# Altium schematic sheet INV.ControlMCU.SchDoc
size 1651 x 1651 mm; SheetNumber: 1; SheetTotal: 3
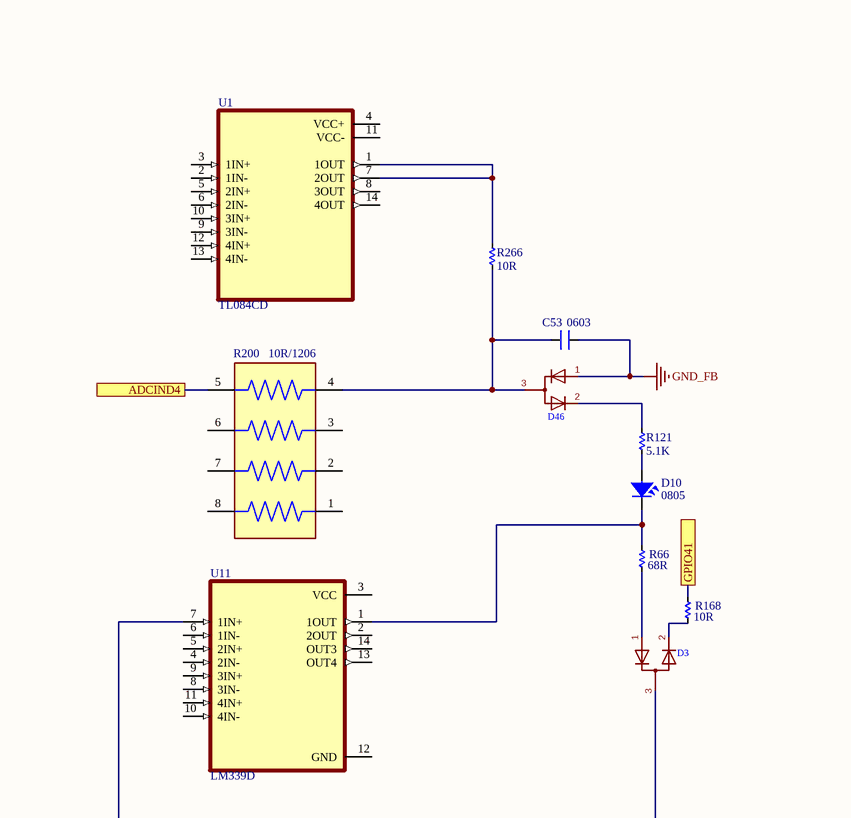
[diagram p0: INV.ControlMCU.SchDoc, top column 1 of 4]
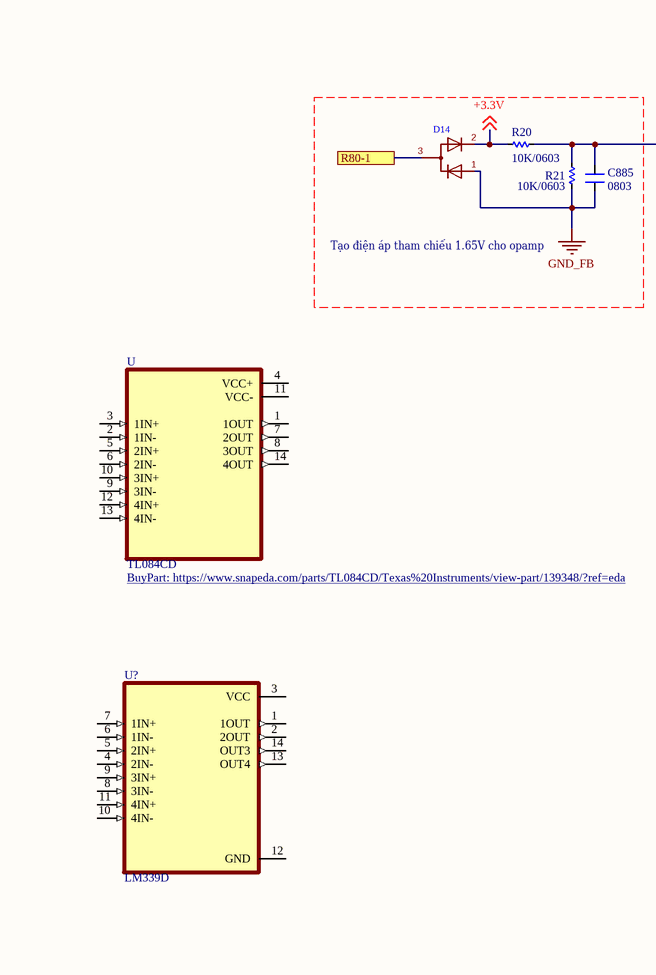
[diagram p1: INV.ControlMCU.SchDoc, top column 3 of 4]
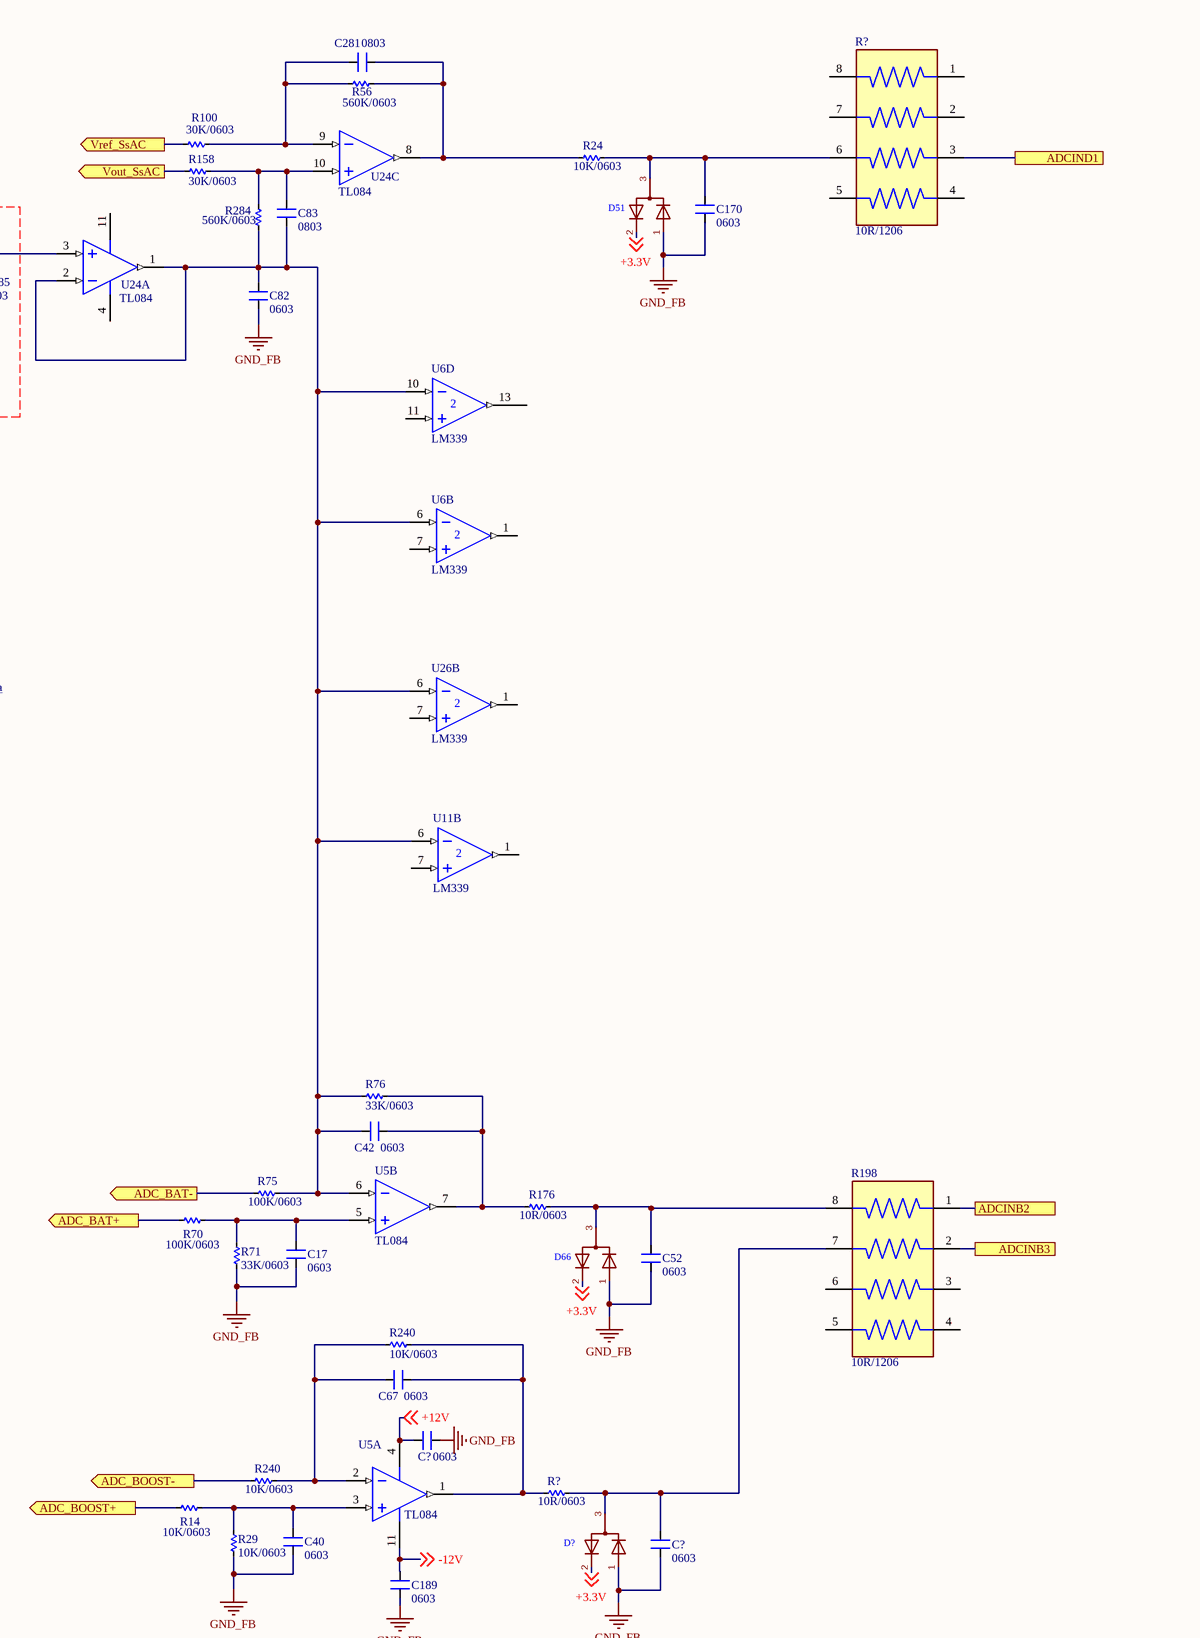
[diagram p2: INV.ControlMCU.SchDoc, top column 4 of 4]
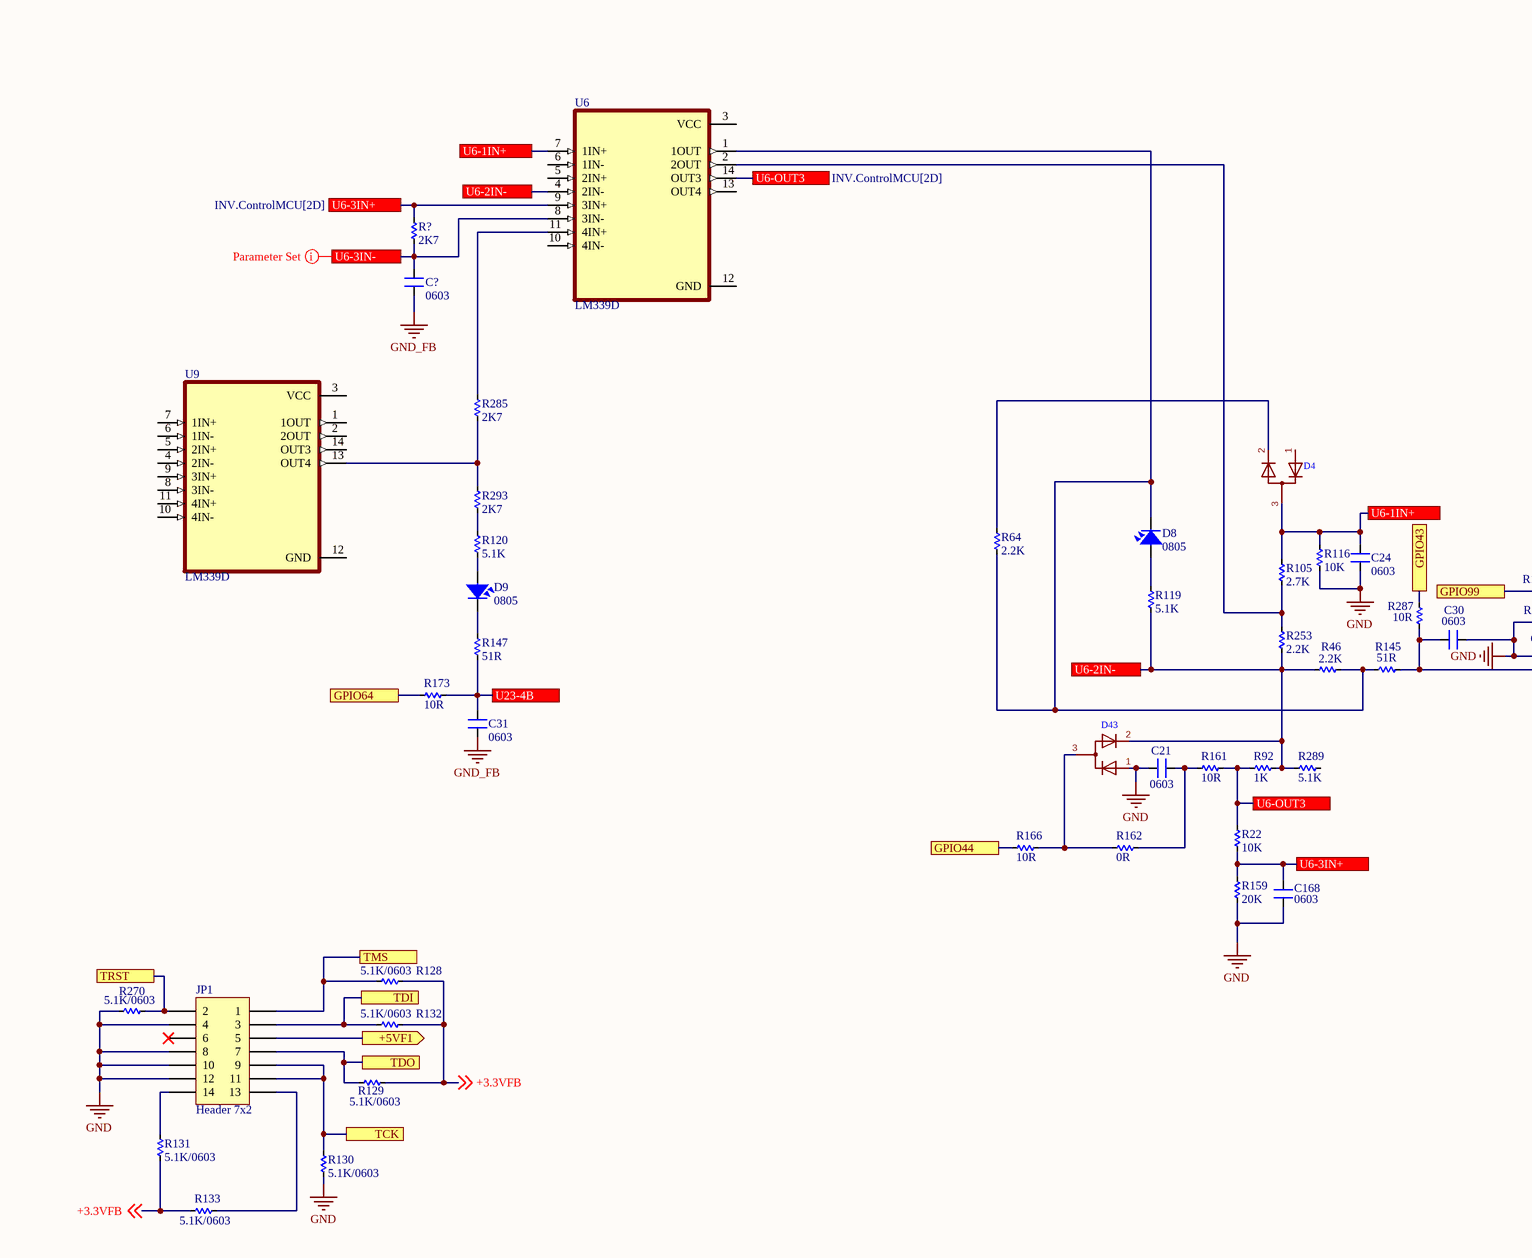
[diagram p3: INV.ControlMCU.SchDoc, centre column 1 of 4]
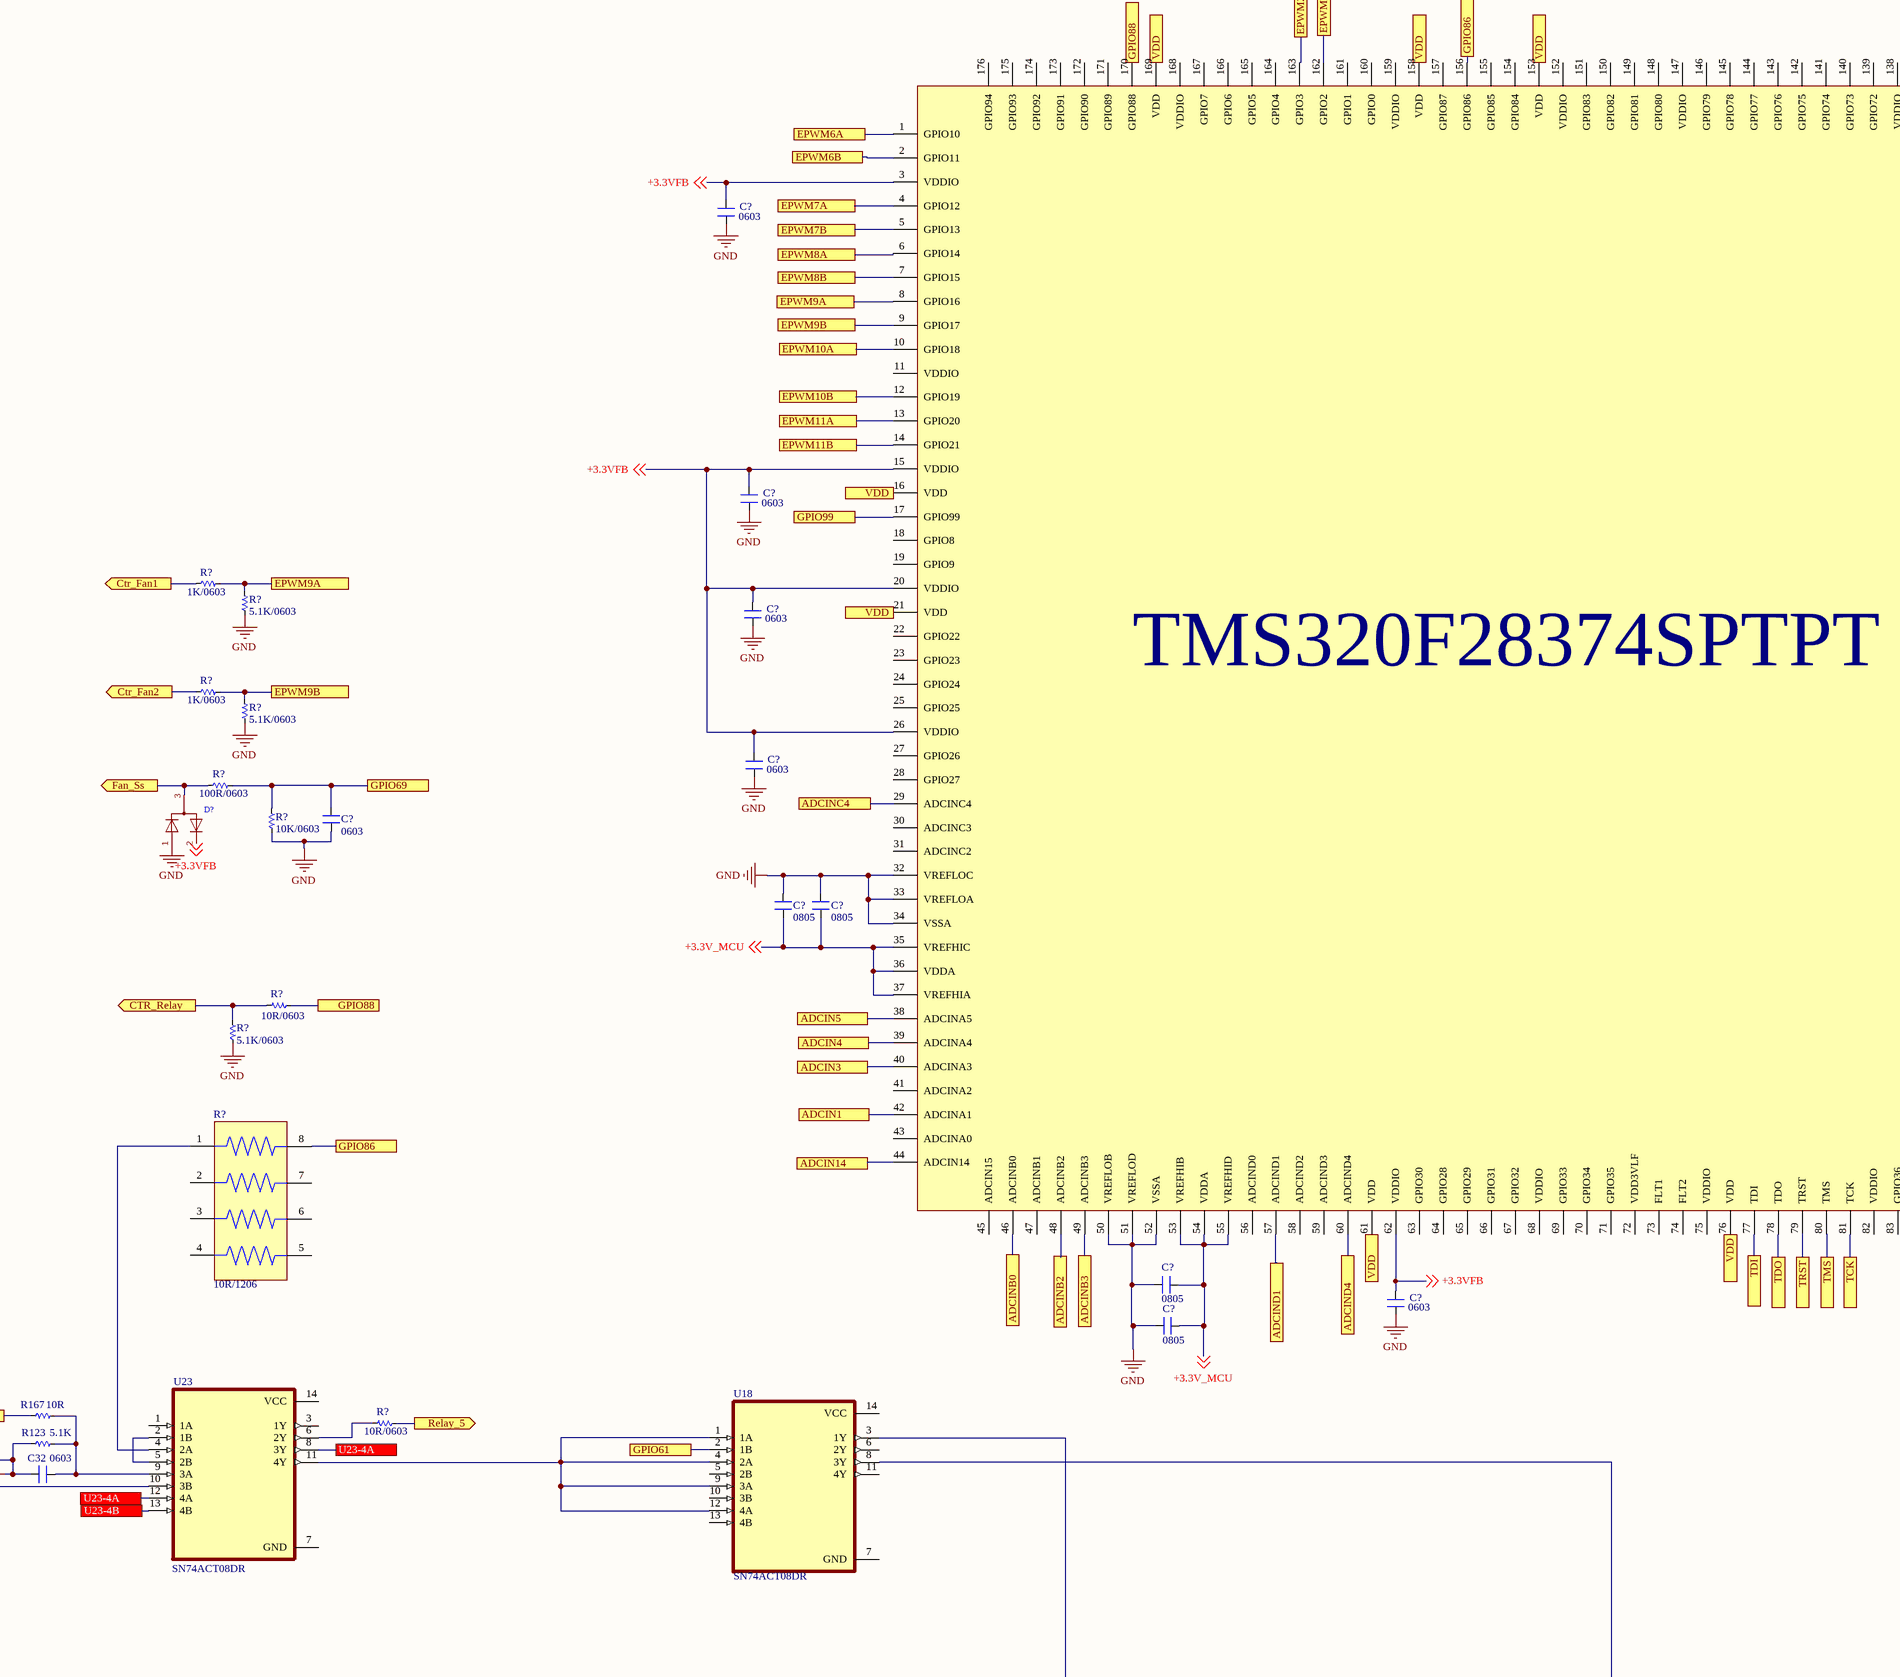
[diagram p4: INV.ControlMCU.SchDoc, centre column 2 of 4]
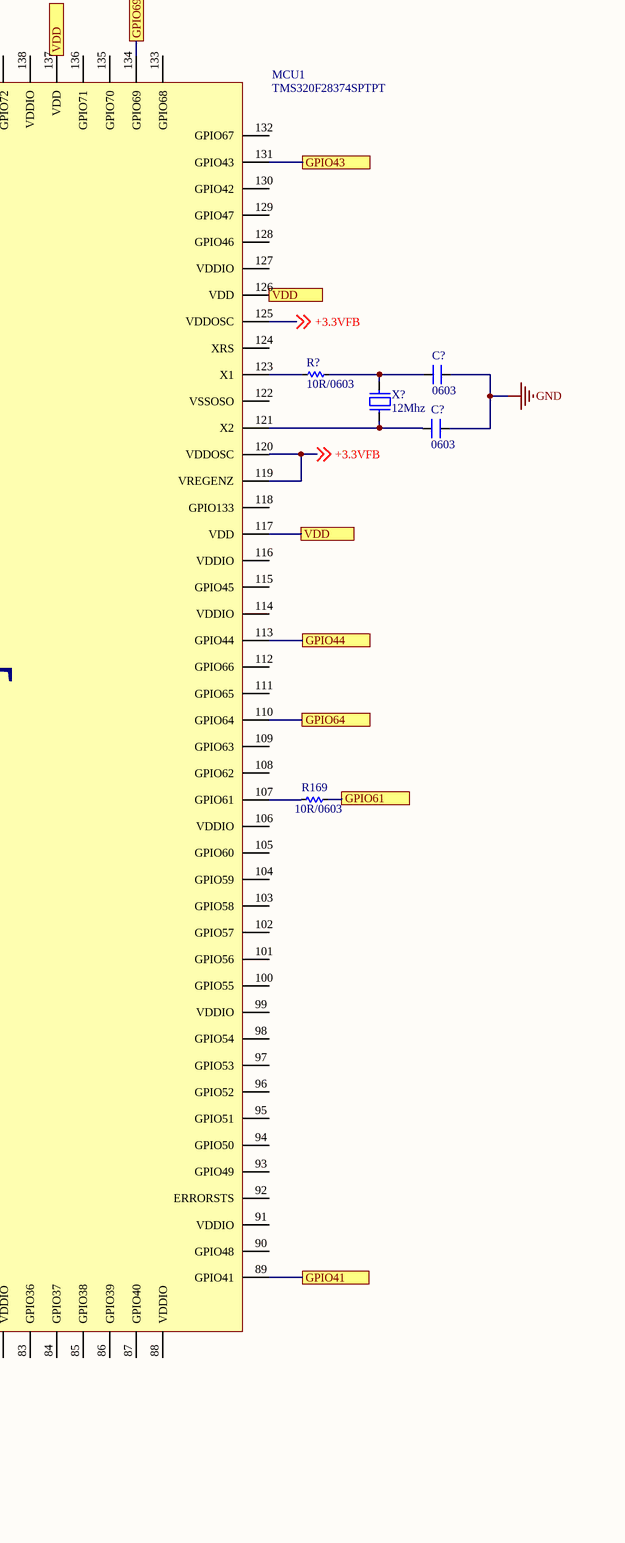
[diagram p5: INV.ControlMCU.SchDoc, centre column 3 of 4]
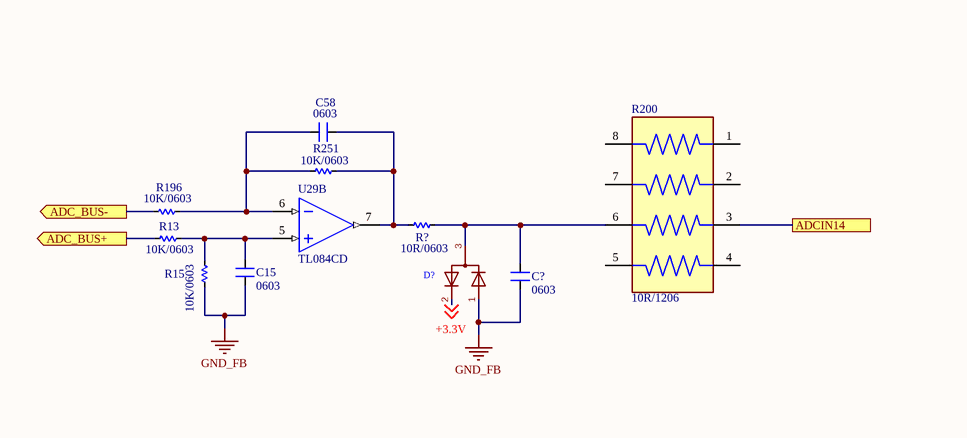
[diagram p6: INV.ControlMCU.SchDoc, centre column 4 of 4]
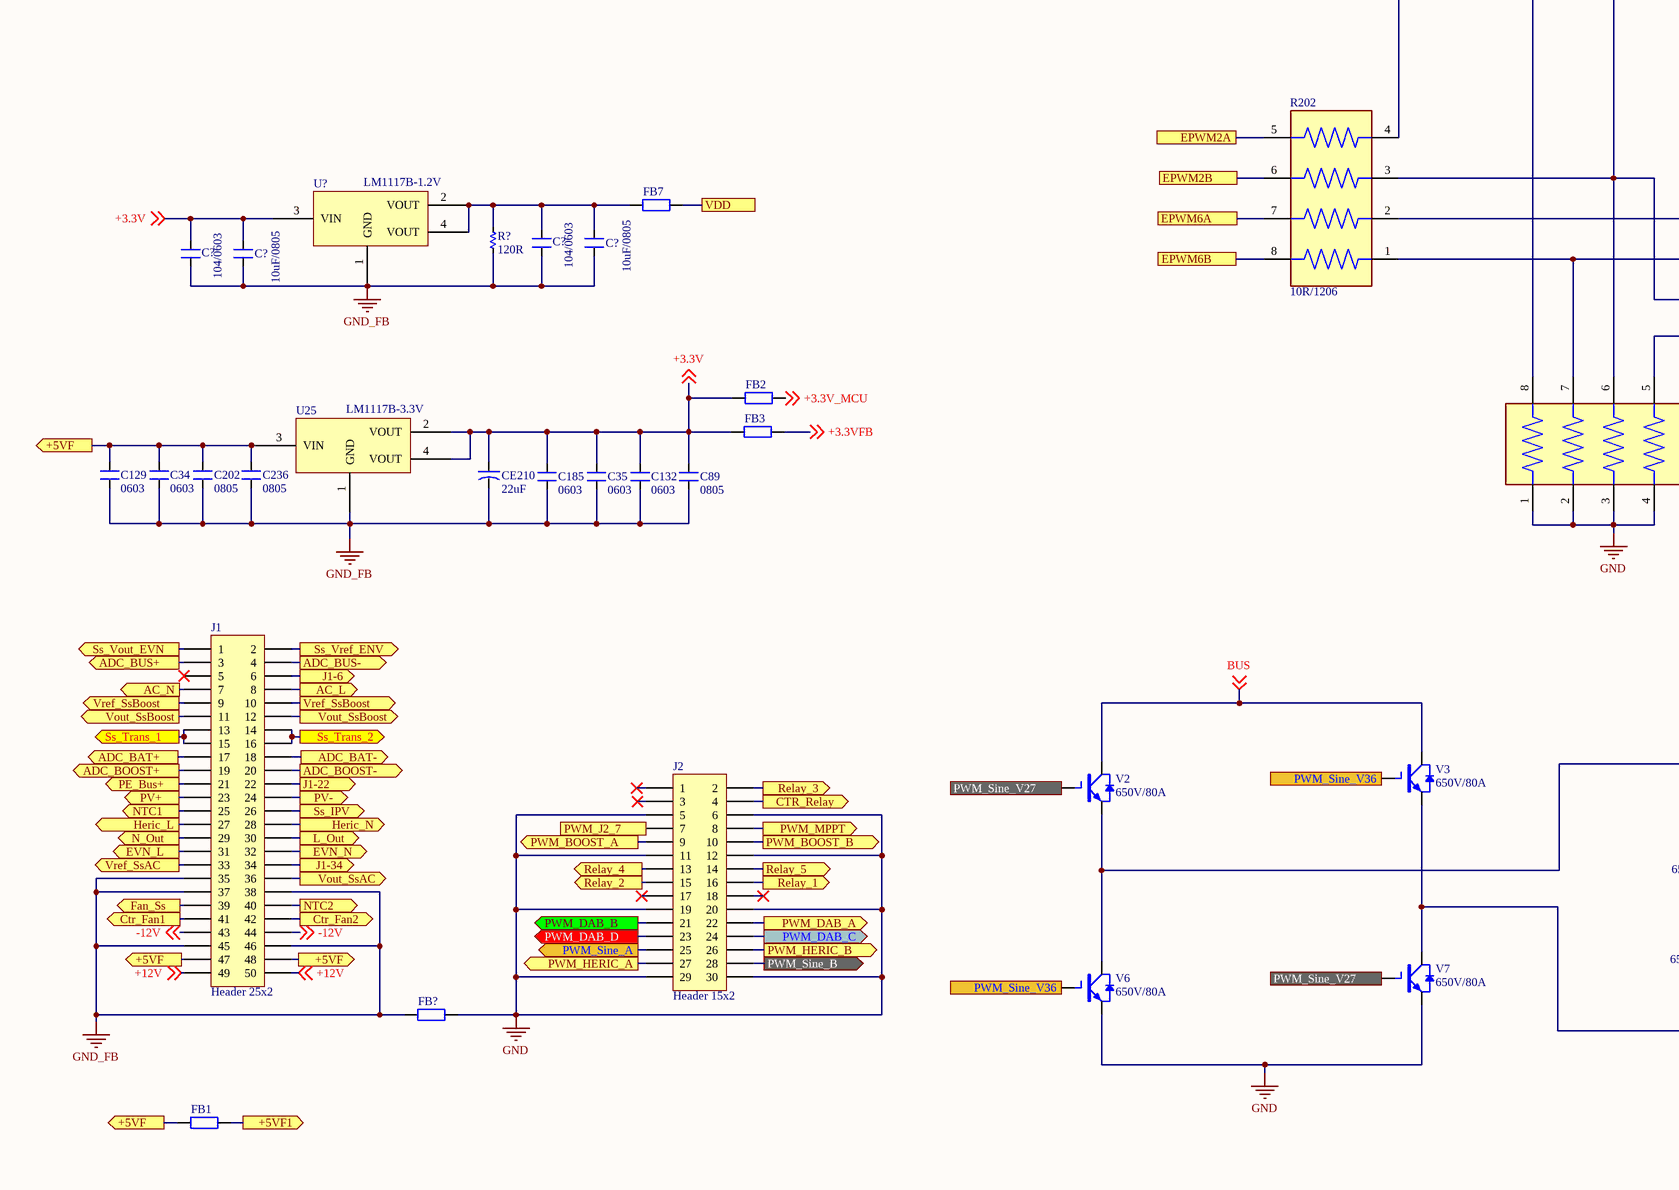
[diagram p7: INV.ControlMCU.SchDoc, bottom column 1 of 4]
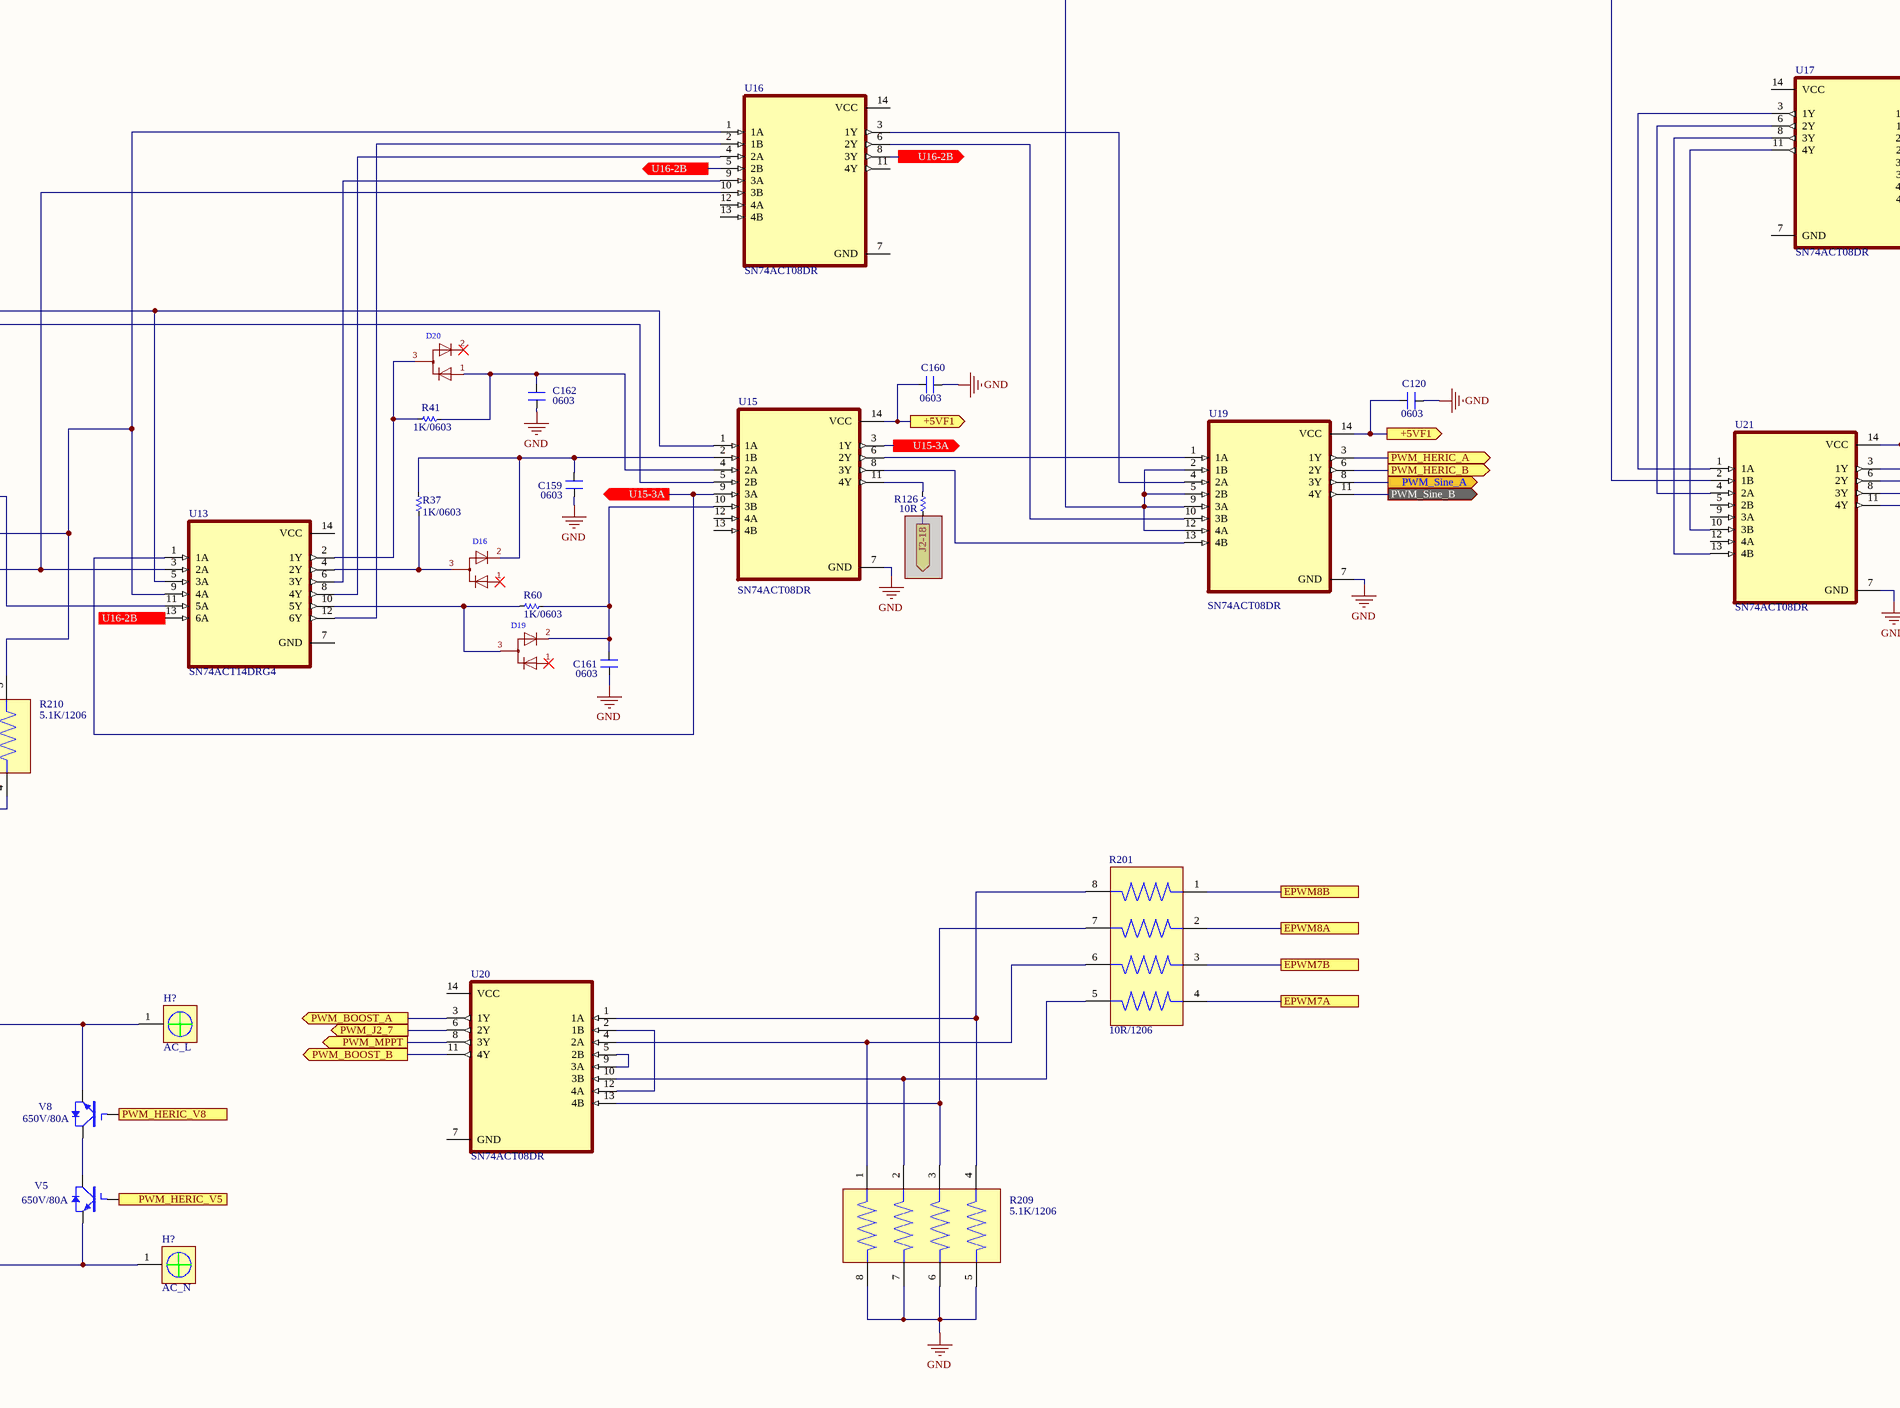
[diagram p8: INV.ControlMCU.SchDoc, bottom column 2 of 4]
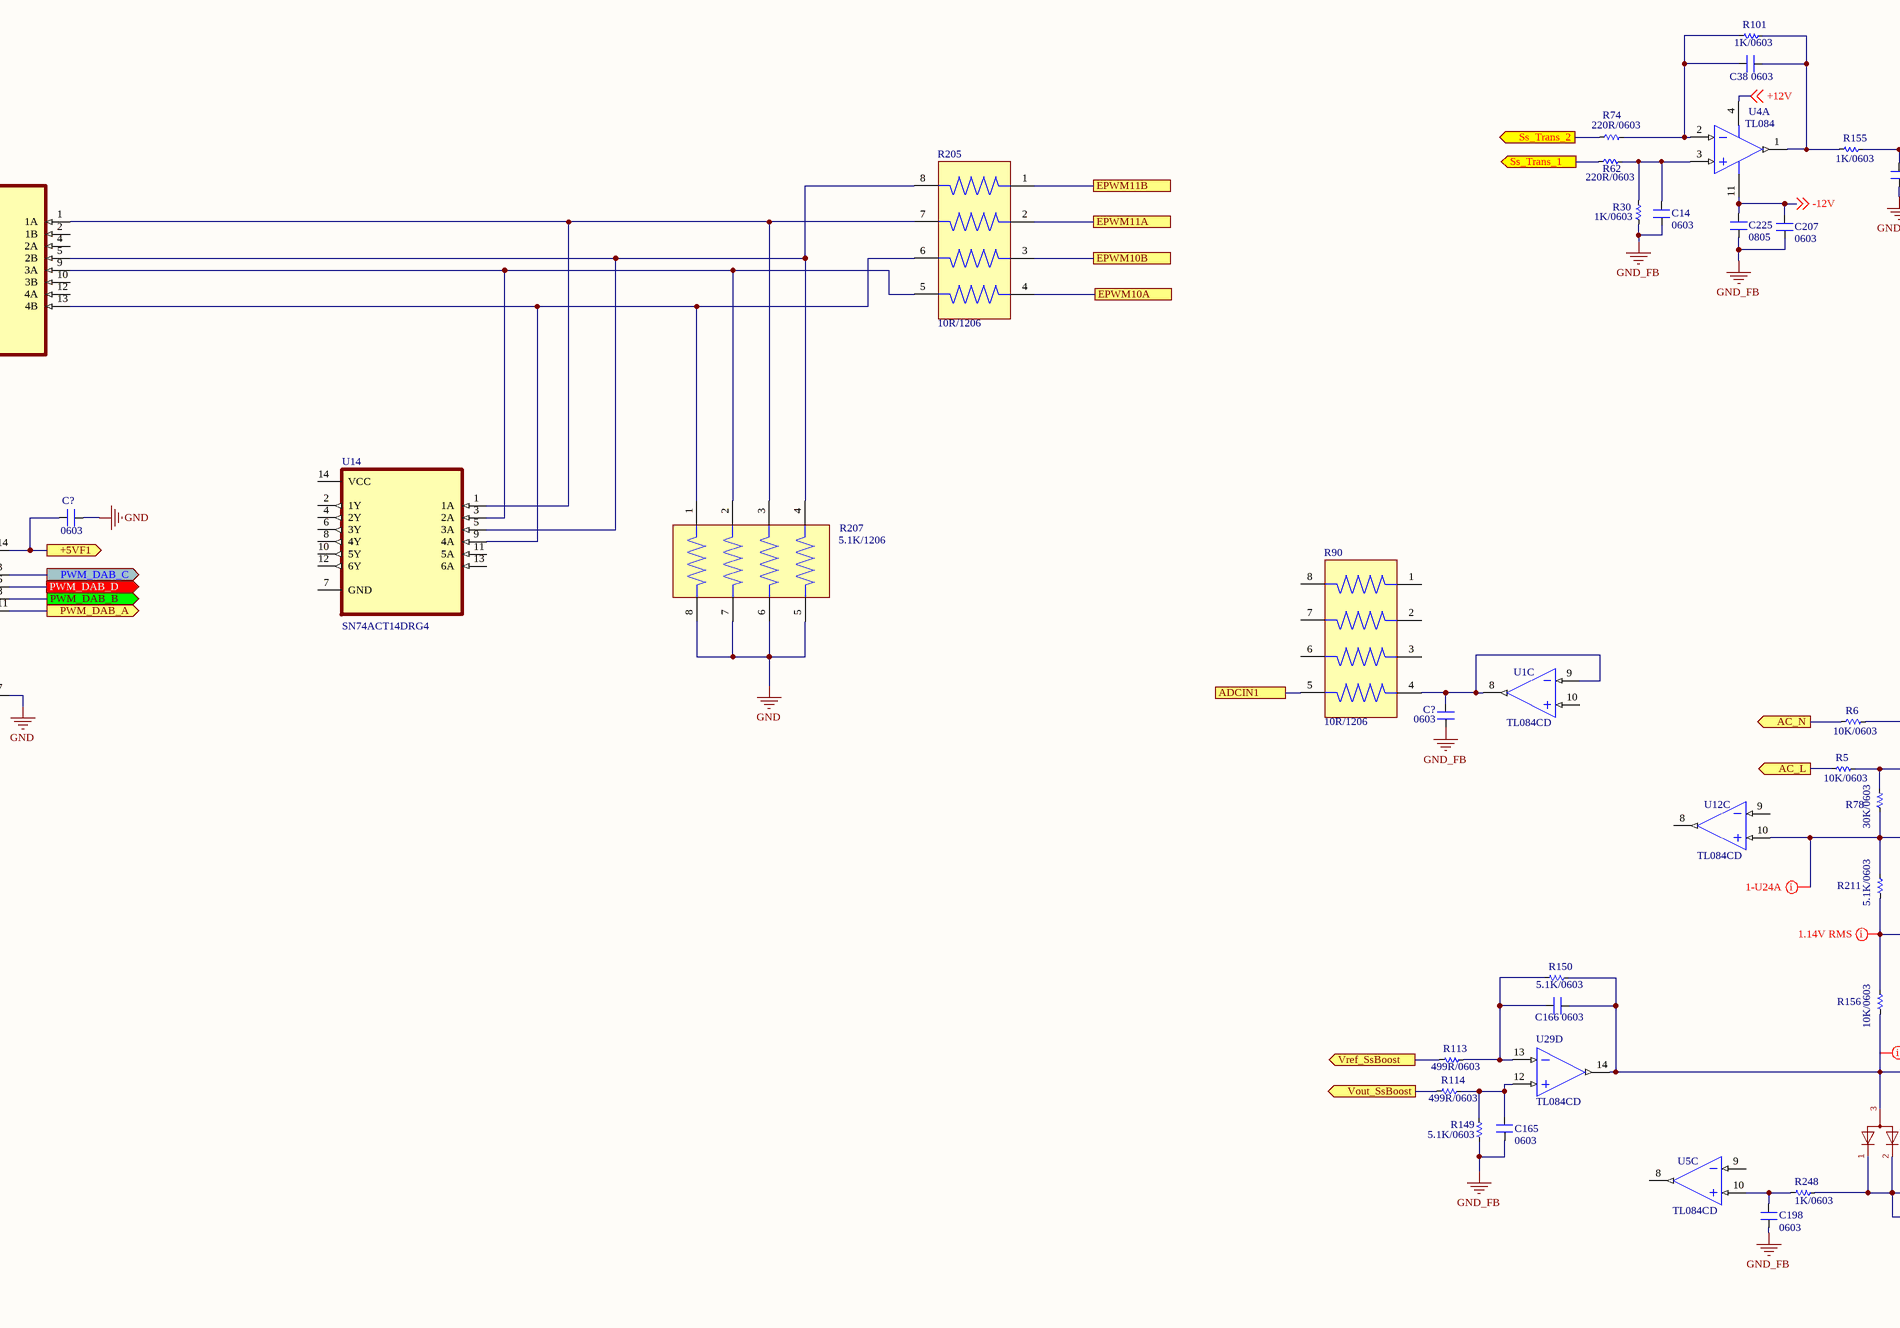
[diagram p9: INV.ControlMCU.SchDoc, bottom column 3 of 4]
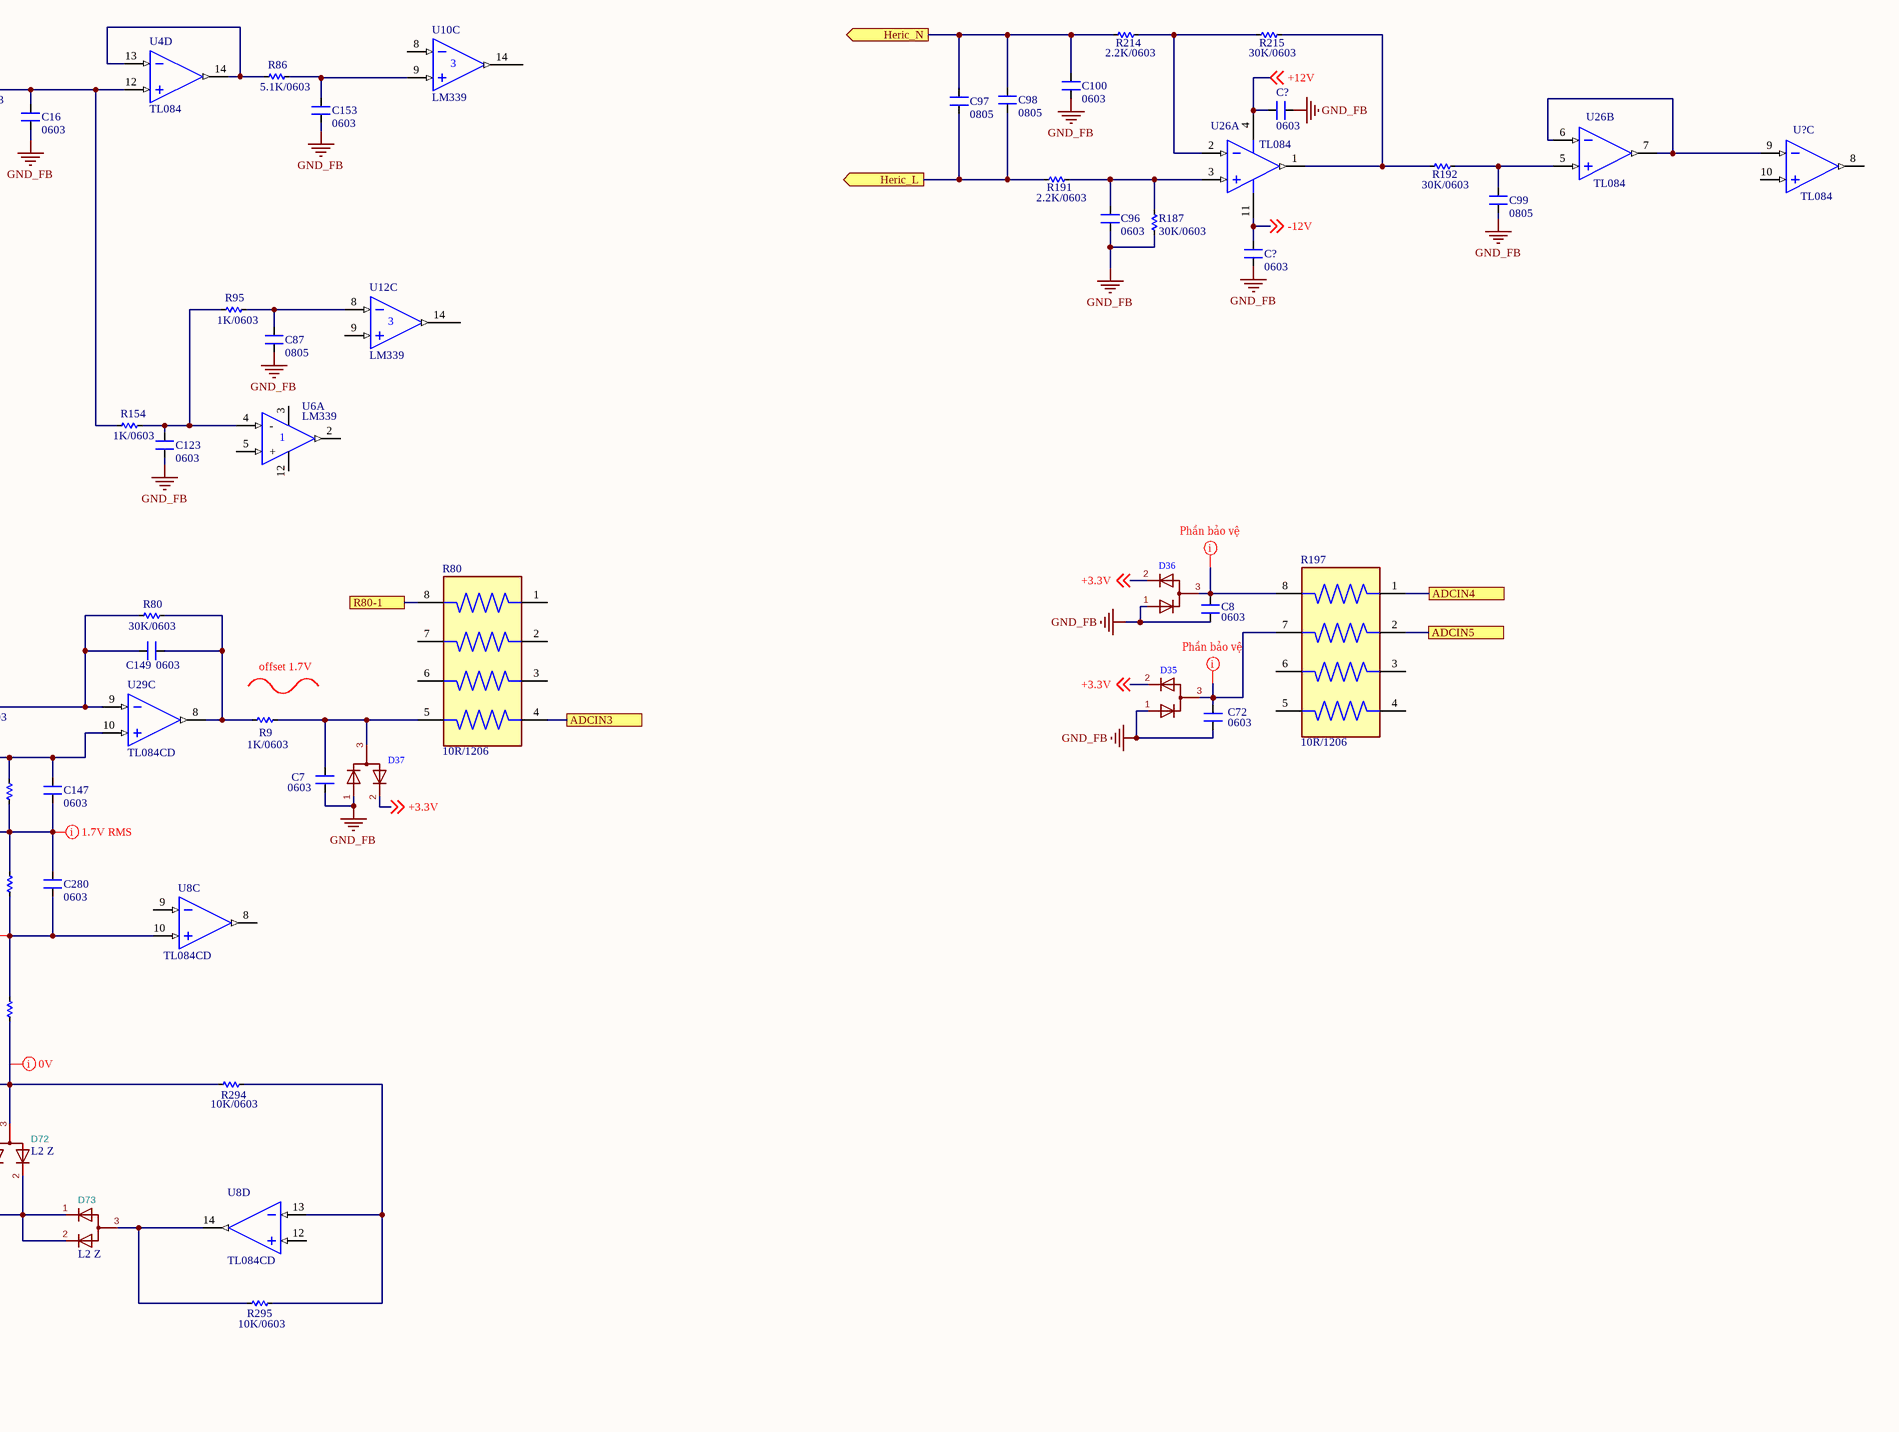
[diagram p10: INV.ControlMCU.SchDoc, bottom column 4 of 4]

## Parts
(Parts that share a designator on the sheet are numbered #1, #2 ... from top to bottom, then left to right.)
C7  0603  [CAP-SMD-0603 EX]
C8  0603  [CAP-SMD-0603 EX]
C14  0603  [CAP-SMD-0603 EX]
C15  0603  [CAP-SMD-0603 EX]
C16  0603  [CAP-SMD-0603 EX]
C17  0603  [CAP-SMD-0603 EX]
C21  0603  [CAP-SMD-0805 EX]
C24  0603  [CAP-SMD-0805 EX]
C30  0603  [CAP-SMD-0805 EX]
C31  0603  [CAP-SMD-0805 EX]
C32  0603  [CAP-SMD-0805 EX]
C34  0603  [CAP-SMD-0805 EX]
C35  0603  [CAP-SMD-0805 EX]
C38  0603  [CAP-SMD-0603 EX]
C40  0603  [CAP-SMD-0603 EX]
C42  0603  [CAP-SMD-0603 EX]
C52  0603  [CAP-SMD-0603 EX]
C53  0603  [CAP-SMD-0805 EX]
C58  0603  [CAP-SMD-0603 EX]
C67  0603  [CAP-SMD-0603 EX]
C72  0603  [CAP-SMD-0603 EX]
C82  0603  [CAP-SMD-0603 EX]
C83  0803  [CAP-SMD-0805 EX]
C87  0805  [CAP-SMD-0805 EX]
C89  0805  [CAP-SMD-0805 EX]
C96  0603  [CAP-SMD-0603 EX]
C97  0805  [CAP-SMD-0805 EX]
C98  0805  [CAP-SMD-0805 EX]
C99  0805  [CAP-SMD-0805 EX]
C100  0603  [CAP-SMD-0603 EX]
C120  0603  [CAP-SMD-0805 EX]
C123  0603  [CAP-SMD-0603 EX]
C129  0603  [CAP-SMD-0805 EX]
C132  0603  [CAP-SMD-0805 EX]
C147  0603  [CAP-SMD-0603 EX]
C149  0603  [CAP-SMD-0603 EX]
C153  0603  [CAP-SMD-0603 EX]
C159  0603  [CAP-SMD-0805 EX]
C160  0603  [CAP-SMD-0805 EX]
C161  0603  [CAP-SMD-0805 EX]
C162  0603  [CAP-SMD-0805 EX]
C165  0603  [CAP-SMD-0603 EX]
C166  0603  [CAP-SMD-0603 EX]
C168  0603  [CAP-SMD-0805 EX]
C170  0603  [CAP-SMD-0603 EX]
C185  0603  [CAP-SMD-0805 EX]
C189  0603  [CAP-SMD-0603 EX]
C198  0603  [CAP-SMD-0603 EX]
C202  0805  [CAP-SMD-0805 EX]
C207  0603  [CAP-SMD-0603 EX]
C225  0805  [CAP-SMD-0805 EX]
C236  0805  [CAP-SMD-0805 EX]
C280  0603  [CAP-SMD-0603 EX]
C281  0803  [CAP-SMD-0805 EX]
C885  0803  [CAP-SMD-0805 EX]
C?#1  0603  [CAP-SMD-0603 EX]
C?#2  0603  [CAP-SMD-0805 EX]
C?#3  0603  [CAP-SMD-0603 EX]
C?#4  0603  [CAP-SMD-0805 EX]
C?#5  0603  [CAP-SMD-0603 EX]
C?#6  0603  [CAP-SMD-0603 EX]
C?#7  0603  [CAP-SMD-0603 EX]
C?#8  0603  [CAP-SMD-0603 EX]
C?#9  0603  [CAP-SMD-0805 EX]
C?#10  0603  [CAP-SMD-0603 EX]
C?#11  0805  [CAP-SMD-0805 EX]
C?#12  0805  [CAP-SMD-0805 EX]
C?#13  0603  [CAP-SMD-0805 EX]
C?#14  0805  [CAP-SMD-0805 EX]
C?#15  0603  [CAP-SMD-0603 EX]
C?#16  0805  [CAP-SMD-0805 EX]
C?#17  0603  [CAP-SMD-0603 EX]
C?#18  0603  [CAP-SMD-0603 EX]
C?#19  0603  [CAP-SMD-0805 EX]
C?#20  104/0603  [CAP-SMD-0603 EX]
C?#21  10uF/0805  [CAP-SMD-0805 EX]
C?#22  104/0603  [CAP-SMD-0603 EX]
C?#23  10uF/0805  [CAP-SMD-0805 EX]
C?#24  0603  [CAP-SMD-0603 EX]
CE210  22uF  [CAP-ALU-SMD-4]
D3  Dual-Diode_CA_1  [SOT-23]  (value not drawn)
D4  Dual-Diode_CA_1  [SOT-23]  (value not drawn)
D8  0805  [LED 3512]
D9  0805  [LED 3512]
D10  0805  [LED 3512]
D14  Dual-Diode_CA_1  [SOT-23]  (value not drawn)
D16  Dual-Diode_CA_1  [SOT-23]  (value not drawn)
D19  Dual-Diode_CA_1  [SOT-23]  (value not drawn)
D20  Dual-Diode_CA_1  [SOT-23]  (value not drawn)
D35  Dual-Diode_CA_1  [SOT-23]  (value not drawn)
D36  Dual-Diode_CA_1  [SOT-23]  (value not drawn)
D37  Dual-Diode_CA_1  [SOT-23]  (value not drawn)
D43  Dual-Diode_CA_1  [SOT-23]  (value not drawn)
D46  Dual-Diode_CA_1  [SOT-23]  (value not drawn)
D51  Dual-Diode_CA_1  [SOT-23]  (value not drawn)
D66  Dual-Diode_CA_1  [SOT-23]  (value not drawn)
D72  L2 Z  [SOT-23]
D73  L2 Z  [SOT-23]
D?#1  Dual-Diode_CA_1  [SOT-23]  (value not drawn)
D?#2  Dual-Diode_CA_1  [SOT-23]  (value not drawn)
D?#3  Dual-Diode_CA_1  [SOT-23]  (value not drawn)
FB1  (no value)  [RESC-0603 (1608)]
FB2  (no value)  [RES-SMD-1206 EX]
FB3  (no value)  [RES-SMD-1206 EX]
FB7  (no value)  [RES-SMD-1206 EX]
FB?  (no value)  [RES-SMD-1206 EX]
H?#1  AC_L  [Copper Pipe]
H?#2  AC_N  [Copper Pipe]
J1  Header 25x2  [Header 2x50]
J2  Header 15x2  [Header 2x15]
JP1  Header 7x2
MCU1  TMS320F28374SPTPT
R5  10K/0603  [RES-SMD-0603 EX]
R6  10K/0603  [RES-SMD-0603 EX]
R9  1K/0603  [RES-SMD-0603 EX]
R13  10K/0603  [RES-SMD-0603 EX]
R14  10K/0603  [RES-SMD-0603 EX]
R15  10K/0603  [RES-SMD-0603 EX]
R20  10K/0603  [RES-SMD-0603 EX]
R21  10K/0603  [RES-SMD-0603 EX]
R22  10K  [RES-SMD-0603 EX]
R24  10K/0603  [RES-SMD-0603 EX]
R29  10K/0603  [RES-SMD-0603 EX]
R30  1K/0603  [RES-SMD-0603 EX]
R37  1K/0603  [RES-SMD-0603]
R41  1K/0603  [RES-SMD-0603]
R46  2.2K  [RES-SMD-0603 EX]
R56  560K/0603  [RES-SMD-0603 EX]
R60  1K/0603  [RES-SMD-0603]
R62  220R/0603  [RES-SMD-0603 EX]
R64  2.2K  [RES-SMD-0603 EX]
R66  68R  [RES-SMD-0603 EX]
R70  100K/0603  [RES-SMD-0603 EX]
R71  33K/0603  [RES-SMD-0603 EX]
R74  220R/0603  [RES-SMD-0603 EX]
R75  100K/0603  [RES-SMD-0603 EX]
R76  33K/0603  [RES-SMD-0603 EX]
R78  30K/0603  [RES-SMD-0603 EX]
R80#1  30K/0603  [RES-SMD-0603 EX]
R80#2  10R/1206  [RESCAXS80P320X150X55-8N]
R86  5.1K/0603  [RES-SMD-0603 EX]
R90  10R/1206  [RESCAXS80P320X150X55-8N]
R92  1K  [RES-SMD-0603 EX]
R95  1K/0603  [RES-SMD-0603 EX]
R100  30K/0603  [RES-SMD-0603 EX]
R101  1K/0603  [RES-SMD-0603 EX]
R105  2.7K  [RES-SMD-0603 EX]
R113  499R/0603  [RES-SMD-0603 EX]
R114  499R/0603  [RES-SMD-0603 EX]
R116  10K  [RES-SMD-0603 EX]
R119  5.1K  [RES-SMD-0603 EX]
R120  5.1K  [RES-SMD-0603 EX]
R121  5.1K  [RES-SMD-0603 EX]
R123  5.1K  [RES-SMD-0603 EX]
R126  10R  [RES-1/2W]
R128  5.1K/0603  [RES-SMD-0603]
R129  5.1K/0603  [RES-SMD-0603]
R130  5.1K/0603  [RES-SMD-0603]
R131  5.1K/0603  [RES-SMD-0603]
R132  5.1K/0603  [RES-SMD-0603]
R133  5.1K/0603  [RES-SMD-0603]
R145  51R  [RES-SMD-0603 EX]
R147  51R  [RES-SMD-0603 EX]
R149  5.1K/0603  [RES-SMD-0603 EX]
R150  5.1K/0603  [RES-SMD-0603 EX]
R154  1K/0603  [RES-SMD-0603 EX]
R155  1K/0603  [RES-SMD-0603 EX]
R156  10K/0603  [RES-SMD-0603 EX]
R158  30K/0603  [RES-SMD-0603 EX]
R159  20K  [RES-SMD-0603 EX]
R161  10R  [RES-SMD-0603 EX]
R162  0R  [RES-SMD-0603 EX]
R166  10R  [RES-SMD-0603 EX]
R167  10R  [RES-SMD-0603 EX]
R168  10R  [RES-SMD-0603 EX]
R169  10R/0603  [RES-SMD-0603 EX]
R173  10R  [RES-SMD-0603 EX]
R176  10R/0603  [RES-SMD-0603 EX]
R187  30K/0603  [RES-SMD-0603 EX]
R191  2.2K/0603  [RES-SMD-0603 EX]
R192  30K/0603  [RES-SMD-0603 EX]
R196  10K/0603  [RES-SMD-0603 EX]
R197  10R/1206  [RESCAXS80P320X150X55-8N]
R198  10R/1206  [RESCAXS80P320X150X55-8N]
R200#1  10R/1206  [RESCAXS80P320X150X55-8N]
R200#2  10R/1206  [RESCAXS80P320X150X55-8N]
R201  10R/1206  [RESCAXS80P320X150X55-8N]
R202  10R/1206  [RESCAXS80P320X150X55-8N]
R205  10R/1206  [RESCAXS80P320X150X55-8N]
R207  5.1K/1206  [RESCAXS80P320X150X55-8N]
R209  5.1K/1206  [RESCAXS80P320X150X55-8N]
R210  5.1K/1206  [RESCAXS80P320X150X55-8N]
R211  5.1K/0603  [RES-SMD-0603 EX]
R214  2.2K/0603  [RES-SMD-0603 EX]
R215  30K/0603  [RES-SMD-0603 EX]
R240#1  10K/0603  [RES-SMD-0603 EX]
R240#2  10K/0603  [RES-SMD-0603 EX]
R248  1K/0603  [RES-SMD-0603 EX]
R251  10K/0603  [RES-SMD-0603 EX]
R253  2.2K  [RES-SMD-0603 EX]
R266  10R  [RES-SMD-0603 EX]
R270  5.1K/0603  [RES-SMD-0603]
R284  560K/0603  [RES-SMD-0603 EX]
R285  2K7  [RES-SMD-0603 EX]
R287  10R  [RES-SMD-0603 EX]
R289  5.1K  [RES-SMD-0603 EX]
R293  2K7  [RES-SMD-0603 EX]
R294  10K/0603  [RES-SMD-0603 EX]
R295  10K/0603  [RES-SMD-0603 EX]
R?#1  10R/1206  [RESCAXS80P320X150X55-8N]
R?#2  10R/0603  [RES-SMD-0603]
R?#3  10R/0603  [RES-SMD-0603 EX]
R?#4  1K/0603  [RES-SMD-0603 EX]
R?#5  5.1K/0603  [RES-SMD-0603 EX]
R?#6  1K/0603  [RES-SMD-0603 EX]
R?#7  5.1K/0603  [RES-SMD-0603 EX]
R?#8  100R/0603  [RES-SMD-0603 EX]
R?#9  10K/0603  [RES-SMD-0603 EX]
R?#10  10R/0603  [RES-SMD-0603 EX]
R?#11  10R/0603  [RES-SMD-0603 EX]
R?#12  5.1K/0603  [RES-SMD-0603 EX]
R?#13  2K7  [RES-SMD-0603 EX]
R?#14  10R/1206  [RESCAXS80P320X150X55-8N]
R?#15  10R/0603  [RES-SMD-0603 EX]
R?#16  120R  [RES-SMD-0603 EX]
U  TL084CD  [SOIC127P600X175-14N]
U1#1  TL084CD  [SOIC127P600X175-14N]
U1#2  TL084CD  [SO14]  (part C of 4)
U4  TL084  [SO14]  (parts A,D of 4)
U5  TL084  [SO14]  (parts A,B,C of 4)
U6#1  LM339D  [SOIC127P600X175-14N]
U6#2  LM339  [DIP14]  (parts A,B,D of 4)
U8  TL084CD  [SO14]  (parts C,D of 4)
U9  LM339D  [SOIC127P600X175-14N]
U10  LM339  [DIP14]  (part C of 4)
U11#1  LM339  [DIP14]  (part B of 4)
U11#2  LM339D  [SOIC127P600X175-14N]
U12#1  LM339  [DIP14]  (part C of 4)
U12#2  TL084CD  [SO14]  (part C of 4)
U13  SN74ACT14DRG4  [SOIC127P600X175-14N]
U14  SN74ACT14DRG4  [SOIC127P600X175-14N]
U15  SN74ACT08DR  [SOIC127P600X175-14N]
U16  SN74ACT08DR  [SOIC127P600X175-14N]
U17  SN74ACT08DR  [SOIC127P600X175-14N]
U18  SN74ACT08DR  [SOIC127P600X175-14N]
U19  SN74ACT08DR  [SOIC127P600X175-14N]
U20  SN74ACT08DR  [SOIC127P600X175-14N]
U21  SN74ACT08DR  [SOIC127P600X175-14N]
U23  SN74ACT08DR  [SOIC127P600X175-14N]
U24  TL084  [SO14]  (parts A,C of 4)
U25  LM1117B-3.3V  [SOT223]
U26#1  LM339  [DIP14]  (part B of 4)
U26#2  TL084  [SO14]  (parts A,B of 4)
U29  TL084CD  [SO14]  (parts B,C,D of 4)
U?#1  LM339D  [SOIC127P600X175-14N]
U?#2  TL084  [SO14]  (part C of 4)
U?#3  LM1117B-1.2V  [SOT223]
V2  650V/80A  [TO-247_1]
V3  650V/80A  [TO-247_1]
V5  650V/80A  [TO-247_1]
V6  650V/80A  [TO-247_1]
V7  650V/80A  [TO-247_1]
V8  650V/80A  [TO-247_1]
X?  12Mhz  [XT2]

## Ports
+5VF1 (out, see INV.ControlMCU[1D], INV.ControlMCU[2D], INV.ControlMCU[3D]), +5VF1 (out, see INV.ControlMCU[1D], INV.ControlMCU[3D]), +5VF (out, see INV.ControlMCU[1D], INV.Main[1D]), AC_L (out, see INV.ControlMCU[1D], INV.Main[1D], INV.Main[4B]), AC_L (out, see INV.ControlMCU[4D], INV.Main[1D], INV.Main[4B]), AC_N (out, see INV.ControlMCU[1D], INV.Main[1D], INV.Main[4B]), AC_N (out, see INV.ControlMCU[4D], INV.Main[1D], INV.Main[4B]), ADC_BAT+ (out, see INV.ControlMCU[1D], INV.Main[1D], INV.Main[2D]), ADC_BAT+ (out, see INV.ControlMCU[5C], INV.Main[1D], INV.Main[2D]), ADC_BAT- (out, see INV.ControlMCU[1D], INV.Main[1D], INV.Main[2D]), ADC_BAT- (out, see INV.ControlMCU[5C], INV.Main[1D], INV.Main[2D]), ADC_BOOST+ (out, see INV.ControlMCU[1D], INV.Main[1D], INV.Main[2A]), ADC_BOOST+ (out, see INV.ControlMCU[5C], INV.Main[1D], INV.Main[2A]), ADC_BOOST- (out, see INV.ControlMCU[1D], INV.Main[1D], INV.Main[2B]), ADC_BOOST- (out, see INV.ControlMCU[5C], INV.Main[1D], INV.Main[2B]), ADC_BUS+ (out, see INV.ControlMCU[1D], INV.Main[1D], INV.Main[3A]), ADC_BUS+ (out, see INV.ControlMCU[5C], INV.Main[1D], INV.Main[3A]), ADC_BUS- (out, see INV.ControlMCU[1D], INV.Main[1D], INV.Main[3A]), ADC_BUS- (out, see INV.ControlMCU[5C], INV.Main[1D], INV.Main[3A]), ADCIN1 (see INV.ControlMCU[2C]), ADCIN1 (see INV.ControlMCU[4D]), ADCIN3 (see INV.ControlMCU[2C]), ADCIN3 (see INV.ControlMCU[5D]), ADCIN4 (see INV.ControlMCU[2C]), ADCIN4 (see INV.ControlMCU[6D]), ADCIN5 (see INV.ControlMCU[2C]), ADCIN5 (see INV.ControlMCU[6D]), ADCIN14 (see INV.ControlMCU[2C]), ADCIN14 (see INV.ControlMCU[5C]), ADCINB0, ADCINB2 (see INV.ControlMCU[2D]), ADCINB2 (see INV.ControlMCU[5C]), ADCINB3 (see INV.ControlMCU[2D]), ADCINB3 (see INV.ControlMCU[5C]), ADCINC4, ADCIND1 (see INV.ControlMCU[3D]), ADCIND1 (see INV.ControlMCU[5B]), ADCIND4 (see INV.ControlMCU[1C]), ADCIND4 (see INV.ControlMCU[3D]), Ctr_Fan1 (out, see INV.ControlMCU[1D], INV.Main[1D], INV.Power[1C], INV.Power[1D]), Ctr_Fan1 (out, see INV.ControlMCU[2C], INV.Main[1D], INV.Power[1C], INV.Power[1D]), Ctr_Fan2 (out, see INV.ControlMCU[1D], INV.Main[1D], INV.Power[1C], INV.Power[1D]), Ctr_Fan2 (out, see INV.ControlMCU[2C], INV.Main[1D], INV.Power[1C], INV.Power[1D]), CTR_Relay (out, see INV.ControlMCU[1D], INV.Main[1D], INV.Power[1D], INV.Power[4A]), CTR_Relay (out, see INV.ControlMCU[2C], INV.Main[1D], INV.Power[1D], INV.Power[4A]), EPWM2A (see INV.ControlMCU[1D]), EPWM2A (see INV.ControlMCU[3C]), EPWM2B (see INV.ControlMCU[1D]), EPWM2B (see INV.ControlMCU[3C]), EPWM6A (see INV.ControlMCU[1D]), EPWM6A (see INV.ControlMCU[2C]), EPWM6B (see INV.ControlMCU[1D]), EPWM6B (see INV.ControlMCU[2C]), EPWM7A (see INV.ControlMCU[2C]), EPWM7A (see INV.ControlMCU[3D]), EPWM7B (see INV.ControlMCU[2C]), EPWM7B (see INV.ControlMCU[3D]), EPWM8A (see INV.ControlMCU[2C]), EPWM8A (see INV.ControlMCU[3D]), EPWM8B (see INV.ControlMCU[2C]), EPWM8B (see INV.ControlMCU[3D]), EPWM9A (see INV.ControlMCU[2C]), EPWM9B (see INV.ControlMCU[2C]), EPWM10A (see INV.ControlMCU[2C]), EPWM10A (see INV.ControlMCU[4D]), EPWM10B (see INV.ControlMCU[2C]), EPWM10B (see INV.ControlMCU[4D]), EPWM11A (see INV.ControlMCU[2C]), EPWM11A (see INV.ControlMCU[4D]), EPWM11B (see INV.ControlMCU[2C]), EPWM11B (see INV.ControlMCU[4D]), EVN_L (out, see INV.Main[1D], INV.Power[1A], INV.Power[1D]), EVN_N (out, see INV.Main[1D], INV.Power[1A], INV.Power[1D]), Fan_Ss (out, see INV.ControlMCU[1D], INV.Main[1D], INV.Power[1C], INV.Power[1D]), Fan_Ss (out, see INV.ControlMCU[2C], INV.Main[1D], INV.Power[1C], INV.Power[1D]), GPIO41 (see INV.ControlMCU[1C]), GPIO41 (see INV.ControlMCU[3C]), GPIO43 (see INV.ControlMCU[2D]), GPIO43 (see INV.ControlMCU[3C]), GPIO44 (see INV.ControlMCU[1D]), GPIO44 (see INV.ControlMCU[3C]), GPIO61 (see INV.ControlMCU[2D]), GPIO61 (see INV.ControlMCU[3C]), GPIO64 (see INV.ControlMCU[1D]), GPIO64 (see INV.ControlMCU[3C]), GPIO69 (see INV.ControlMCU[2C]), GPIO69 (see INV.ControlMCU[3C]), GPIO86 (see INV.ControlMCU[2C]), GPIO86 (see INV.ControlMCU[3C]), GPIO88 (see INV.ControlMCU[2C]), GPIO88 (see INV.ControlMCU[3C]), GPIO99 (see INV.ControlMCU[2C]), GPIO99 (see INV.ControlMCU[2D]), Heric_L (out, see INV.ControlMCU[1D], INV.Main[1D], INV.Main[4B]), Heric_L (out, see INV.ControlMCU[5D], INV.Main[1D], INV.Main[4B]), Heric_N (out, see INV.ControlMCU[1D], INV.Main[1D], INV.Main[4C]), Heric_N (out, see INV.ControlMCU[5D], INV.Main[1D], INV.Main[4C]), J1-6 (out, see INV.Main[1D], INV.Main[3C]), J1-22 (out, see INV.Main[1D]), J1-34 (out, see INV.Main[1D], INV.Main[3D]), J2-18 (out, see INV.ControlMCU[3D], INV.Main[1D]), L_Out (out, see INV.Main[1D], INV.Power[1D], INV.Power[3A]), N_Out (out, see INV.Main[1D], INV.Power[1D], INV.Power[3A]), NTC1 (out, see INV.Main[1D], INV.Main[2C]), NTC2 (out, see INV.Main[1D], INV.Main[2C]), PE_Bus+ (out, see INV.Main[1D], INV.Power[1D], INV.Power[5B]), PV+ (out, see INV.Main[1D], INV.Power[1D], INV.Power[2D]), PV- (out, see INV.Main[1D], INV.Power[1D], INV.Power[2D]), PWM_BOOST_A (out, see INV.ControlMCU[1D], INV.Main[1D], INV.Main[2B]), PWM_BOOST_A (out, see INV.ControlMCU[2D], INV.Main[1D], INV.Main[2B]), PWM_BOOST_B (out, see INV.ControlMCU[1D], INV.Main[1D], INV.Main[3B]), PWM_BOOST_B (out, see INV.ControlMCU[2D], INV.Main[1D], INV.Main[3B]), PWM_DAB_A (out, see INV.ControlMCU[1D], INV.Main[1B], INV.Main[1D]), PWM_DAB_A (out, see INV.ControlMCU[3D], INV.Main[1B], INV.Main[1D]), PWM_DAB_B (out, see INV.ControlMCU[1D], INV.Main[1B], INV.Main[1D]), PWM_DAB_B (out, see INV.ControlMCU[3D], INV.Main[1B], INV.Main[1D]), PWM_DAB_C (out, see INV.ControlMCU[1D], INV.Main[1D], INV.Main[2B]), PWM_DAB_C (out, see INV.ControlMCU[3D], INV.Main[1D], INV.Main[2B]), PWM_DAB_D (out, see INV.ControlMCU[1D], INV.Main[1D], INV.Main[2B]), PWM_DAB_D (out, see INV.ControlMCU[3D], INV.Main[1D], INV.Main[2B]), PWM_HERIC_A (out, see INV.ControlMCU[1D], INV.Main[1D], INV.Main[4B]), PWM_HERIC_A (out, see INV.ControlMCU[3D], INV.Main[1D], INV.Main[4B]), PWM_HERIC_B (out, see INV.ControlMCU[1D], INV.Main[1D], INV.Main[4B]), PWM_HERIC_B (out, see INV.ControlMCU[3D], INV.Main[1D], INV.Main[4B]), PWM_HERIC_V5 (out), PWM_HERIC_V8 (out), PWM_J2_7 (out, see INV.ControlMCU[1D]), PWM_J2_7 (out, see INV.ControlMCU[2D]), PWM_MPPT (out, see INV.ControlMCU[1D], INV.Main[1D], INV.Main[4D]), PWM_MPPT (out, see INV.ControlMCU[2D], INV.Main[1D], INV.Main[4D]), PWM_Sine_A (out, see INV.ControlMCU[1D], INV.Main[1D], INV.Main[3B]), PWM_Sine_A (out, see INV.ControlMCU[3D], INV.Main[1D], INV.Main[3B]), PWM_Sine_B (out, see INV.ControlMCU[1D], INV.Main[1D], INV.Main[3B]), PWM_Sine_B (out, see INV.ControlMCU[3D], INV.Main[1D], INV.Main[3B]), PWM_Sine_V27 (out, see INV.ControlMCU[1D]), PWM_Sine_V36 (out, see INV.ControlMCU[1D]), R80-1 (see INV.ControlMCU[4B]), R80-1 (see INV.ControlMCU[5D]), Relay_1 (out, see INV.Main[1D], INV.Power[1D], INV.Power[4A]), Relay_2 (out, see INV.Main[1D], INV.Power[1D], INV.Power[4A]), Relay_3 (out, see INV.Main[1D], INV.Power[1D], INV.Power[4A]), Relay_4 (out, see INV.Main[1D], INV.Power[1D], INV.Power[4B]), Relay_5 (out, see INV.ControlMCU[1D], INV.Main[1D], INV.Power[1D], INV.Power[4B]), Relay_5 (out, see INV.ControlMCU[2D], INV.Main[1D], INV.Power[1D], INV.Power[4B]), Ss_IPV (out, see INV.Main[1D], INV.Power[1D], INV.Power[2C]), Ss_Trans_1 (out, see INV.ControlMCU[1D], INV.Main[1D], INV.Main[2B]), Ss_Trans_1 (out, see INV.ControlMCU[4D], INV.Main[1D], INV.Main[2B]), Ss_Trans_2 (out, see INV.ControlMCU[1D], INV.Main[1D], INV.Main[2B]), Ss_Trans_2 (out, see INV.ControlMCU[4D], INV.Main[1D], INV.Main[2B]), Ss_Vout_EVN (out, see INV.Main[1D], INV.Power[1A], INV.Power[1D]), Ss_Vref_ENV (out, see INV.Main[1D], INV.Power[1A], INV.Power[1D]), TCK (see INV.ControlMCU[1D]), TCK (see INV.ControlMCU[3D]), TDI (see INV.ControlMCU[1D]), TDI (see INV.ControlMCU[3D]), TDO (see INV.ControlMCU[1D]), TDO (see INV.ControlMCU[3D]), TMS (see INV.ControlMCU[1D]), TMS (see INV.ControlMCU[3D]), TRST (see INV.ControlMCU[1D]), TRST (see INV.ControlMCU[3D]), U6-1IN+ (see INV.ControlMCU[1C]), U6-1IN+ (see INV.ControlMCU[2D]), U6-2IN- (see INV.ControlMCU[1C]), U6-2IN- (see INV.ControlMCU[1D]), U6-3IN+ (see INV.ControlMCU[1C]), U6-3IN+ (see INV.ControlMCU[2D]), U6-3IN-, U6-OUT3 (see INV.ControlMCU[1C]), U6-OUT3 (see INV.ControlMCU[2D]), U15-3A (out, see INV.ControlMCU[2D]), U16-2B (out, see INV.ControlMCU[2D]), U23-4A (see INV.ControlMCU[2D]), U23-4B (see INV.ControlMCU[1D]), U23-4B (see INV.ControlMCU[2D]), VDD (see INV.ControlMCU[1D], INV.ControlMCU[2C], INV.ControlMCU[3C]), VDD (see INV.ControlMCU[2C], INV.ControlMCU[3C]), Vout_SsAC (out, see INV.ControlMCU[1D], INV.Main[1D], INV.Main[4A]), Vout_SsAC (out, see INV.ControlMCU[5B], INV.Main[1D], INV.Main[4A]), Vout_SsBoost (out, see INV.ControlMCU[1D], INV.ControlMCU[4D], INV.Main[1D], INV.Main[3A]), Vout_SsBoost (out, see INV.ControlMCU[1D], INV.Main[1D], INV.Main[3A]), Vref_SsAC (out, see INV.ControlMCU[1D], INV.Main[1D], INV.Main[4A]), Vref_SsAC (out, see INV.ControlMCU[5B], INV.Main[1D], INV.Main[4A]), Vref_SsBoost (out, see INV.ControlMCU[1D], INV.ControlMCU[4D], INV.Main[1D], INV.Main[3A]), Vref_SsBoost (out, see INV.ControlMCU[1D], INV.Main[1D], INV.Main[3A])

## Nets
GND: C21.2 C24.2 C30.1 C32.2 C120.1 C159.1 C160.1 C161.1 C162.1 C168.2 C?#1.1 C?#2.1 C?#4.1 C?#6.1 C?#7.1 C?#8.1 C?#9.2 C?#11.1 C?#12.1 C?#14.1 C?#15.1 C?#16.1 C?#19.1 D43.1(C) D?#2.1(C) FB?.1 J2.5 J2.6 J2.11 J2.12 J2.19 J2.20 J2.29 J2.30 JP1.4 JP1.8 JP1.10 JP1.12 MCU1.32(VREFLOC) MCU1.33(VREFLOA) MCU1.34(VSSA) MCU1.50(VREFLOB) MCU1.51(VREFLOD) MCU1.52(VSSA) R116.1 R123.2 R130.2 R159.1 R207.5 R207.6 R207.7 R207.8 R209.5 R209.6 R209.7 R209.8 R210.1 R210.2 R210.3 R210.4 R270.1 R?#5.2 R?#7.2 R?#9.1 R?#12.1 U15.7(GND) U19.7(GND) U21.7(GND) V6.3(E) V7.3(E)
GND_FB: C7.1 C8.1 C14.1 C15.1 C16.1 C17.2 C31.1 C34.1 C35.1 C40.2 C52.2 C53.1 C72.1 C82.1 C87.1 C89.1 C96.2 C99.2 C100.2 C123.1 C129.1 C132.1 C153.1 C165.2 C170.2 C185.1 C189.1 C198.1 C202.1 C207.1 C225.1 C236.1 C885.1 C?#3.2 C?#5.2 C?#10.2 C?#13.1 C?#17.2 C?#18.2 C?#20.1 C?#21.1 C?#22.1 C?#23.1 C?#24.2 CE210.2 D14.1(C) D35.1(C) D36.1(C) D37.1(C) D46.1(C) D51.1(C) D66.1(C) D?#1.1(C) D?#3.1(C) FB?.2 J1.35 J1.37 J1.38 J1.45 J1.46 R15.2 R21.2 R29.1 R30.2 R71.1 R149.2 R187.1 R?#16.1 U25.1(GND) U?#3.1(GND)
+3.3V: C35.2 C89.2 C132.2 C185.2 C?#22.2 C?#23.2 CE210.1 D14.2(C) D35.2(C) D36.2(C) D37.2(C) D51.2(C) D66.2(C) D?#1.2(C) D?#3.2(C) FB2.1 FB3.2 R20.1 U25.2(VOUT) U25.4(VOUT) U?#3.3(VIN) ; off-sheet +3.3V
+3.3V_MCU: C?#11.2 C?#12.2 C?#14.2 C?#16.2 FB2.2 MCU1.35(VREFHIC) MCU1.36(VDDA) MCU1.37(VREFHIA) MCU1.53(VREFHIB) MCU1.54(VDDA) MCU1.55(VREFHID) ; off-sheet +3.3V_MCU
+3.3VFB: C?#1.2 C?#6.2 C?#7.2 C?#8.2 C?#15.2 D?#2.2(C) FB3.1 MCU1.3(VDDIO) MCU1.15(VDDIO) MCU1.20(VDDIO) MCU1.26(VDDIO) MCU1.62(VDDIO) MCU1.119(VREGENZ) MCU1.120(VDDOSC) MCU1.125(VDDOSC) R128.2 R129.2 R131.2 R132.2 R133.2 ; off-sheet +3.3VFB
+5VF: C34.2 C129.2 C202.2 C236.2 FB1.1 J1.47 J1.48 U25.3(VIN) ; port +5VF
+5VF1: C120.2 C160.2 C?#19.2 FB1.2 JP1.5 U15.14(VCC) U19.14(VCC) U21.14(VCC) ; port +5VF1
+12V: C?#3.1 C?#17.1 J1.49 J1.50 U4.4(VCC) U5.4(VCC) U26#2.4(VCC) ; off-sheet +12V
-12V: C189.2 C207.2 C225.2 C?#18.1 J1.43 J1.44 U4.11(VEE) U5.11(VEE) U26#2.11(VEE) ; off-sheet -12V
AC_L: J1.8 R5.2 ; port AC_L
AC_N: J1.7 R6.2 ; port AC_N
ADC_BAT+: J1.17 R70.1 ; port ADC_BAT+
ADC_BAT-: J1.18 R75.1 ; port ADC_BAT-
ADC_BOOST+: J1.19 R14.1 ; port ADC_BOOST+
ADC_BOOST-: J1.20 R240#2.1 ; port ADC_BOOST-
ADC_BUS+: J1.3 R13.2 ; port ADC_BUS+
ADC_BUS-: J1.4 R196.2 ; port ADC_BUS-
ADCIN1: MCU1.42(ADCINA1) R90.5 ; port ADCIN1
ADCIN3: MCU1.40(ADCINA3) R80#2.4 ; port ADCIN3
ADCIN4: MCU1.39(ADCINA4) R197.1 ; port ADCIN4
ADCIN5: MCU1.38(ADCINA5) R197.2 ; port ADCIN5
ADCIN14: MCU1.44(ADCIN14) R200#2.3 ; port ADCIN14
ADCINB0: MCU1.46(ADCINB0) ; port ADCINB0
ADCINB2: MCU1.48(ADCINB2) R198.1 ; port ADCINB2
ADCINB3: MCU1.49(ADCINB3) R198.2 ; port ADCINB3
ADCINC4: MCU1.29(ADCINC4) ; port ADCINC4
ADCIND1: MCU1.57(ADCIND1) R?#1.3 ; port ADCIND1
ADCIND4: MCU1.60(ADCIND4) R200#1.5 ; port ADCIND4
BUS: V2.2(C) V3.2(C) ; off-sheet BUS
Ctr_Fan1: J1.41 R?#4.2 ; port Ctr_Fan1
Ctr_Fan2: J1.42 R?#6.2 ; port Ctr_Fan2
CTR_Relay: J2.4 R?#11.1 R?#12.2 ; port CTR_Relay
EPWM2A: MCU1.162(GPIO2) R202.5 ; port EPWM2A
EPWM2B: MCU1.163(GPIO3) R202.6 ; port EPWM2B
EPWM6A: MCU1.1(GPIO10) R202.7 ; port EPWM6A
EPWM6B: MCU1.2(GPIO11) R202.8 ; port EPWM6B
EPWM7A: MCU1.4(GPIO12) R201.4 ; port EPWM7A
EPWM7B: MCU1.5(GPIO13) R201.3 ; port EPWM7B
EPWM8A: MCU1.6(GPIO14) R201.2 ; port EPWM8A
EPWM8B: MCU1.7(GPIO15) R201.1 ; port EPWM8B
EPWM9A: MCU1.8(GPIO16) R?#4.1 R?#5.1 ; port EPWM9A
EPWM9B: MCU1.9(GPIO17) R?#6.1 R?#7.1 ; port EPWM9B
EPWM10A: MCU1.10(GPIO18) R205.4 ; port EPWM10A
EPWM10B: MCU1.12(GPIO19) R205.3 ; port EPWM10B
EPWM11A: MCU1.13(GPIO20) R205.2 ; port EPWM11A
EPWM11B: MCU1.14(GPIO21) R205.1 ; port EPWM11B
EVN_L: J1.31 ; port EVN_L
EVN_N: J1.32 ; port EVN_N
Fan_Ss: D?#2.3(A) J1.39 R?#8.2 ; port Fan_Ss
GPIO41: MCU1.89(GPIO41) R168.1 ; port GPIO41
GPIO43: MCU1.131(GPIO43) R287.2 ; port GPIO43
GPIO44: MCU1.113(GPIO44) R166.1 ; port GPIO44
GPIO61: R169.1 U18.2(1B) ; port GPIO61
GPIO64: MCU1.110(GPIO64) R173.2 ; port GPIO64
GPIO69: C?#9.1 MCU1.134(GPIO69) R?#8.1 R?#9.2 ; port GPIO69
GPIO86: MCU1.156(GPIO86) R?#14.8 ; port GPIO86
GPIO88: MCU1.170(GPIO88) R?#11.2 ; port GPIO88
GPIO99: MCU1.17(GPIO99) R167.2 ; port GPIO99
Heric_L: C97.2 C98.2 J1.27 R191.2 ; port Heric_L
Heric_N: C97.1 C98.1 C100.1 J1.28 R214.2 ; port Heric_N
J1-6: J1.6 ; port J1-6
J1-22: J1.22 ; port J1-22
J1-34: J1.34 ; port J1-34
L_Out: J1.30 ; port L_Out
N_Out: J1.29 ; port N_Out
NTC1: J1.25 ; port NTC1
NTC2: J1.40 ; port NTC2
PE_Bus+: J1.21 ; port PE_Bus+
PV+: J1.23 ; port PV+
PV-: J1.24 ; port PV-
PWM_BOOST_A: J2.9 U20.3(1Y) ; port PWM_BOOST_A
PWM_BOOST_B: J2.10 U20.11(4Y) ; port PWM_BOOST_B
PWM_DAB_A: J2.22 U21.11(4Y) ; port PWM_DAB_A
PWM_DAB_B: J2.21 U21.8(3Y) ; port PWM_DAB_B
PWM_DAB_C: J2.24 U21.3(1Y) ; port PWM_DAB_C
PWM_DAB_D: J2.23 U21.6(2Y) ; port PWM_DAB_D
PWM_HERIC_A: J2.27 U19.3(1Y) ; port PWM_HERIC_A
PWM_HERIC_B: J2.26 U19.6(2Y) ; port PWM_HERIC_B
PWM_HERIC_V5: V5.1(G) ; port PWM_HERIC_V5
PWM_HERIC_V8: V8.1(G) ; port PWM_HERIC_V8
PWM_J2_7: J2.7 U20.6(2Y) ; port PWM_J2_7
PWM_MPPT: J2.8 U20.8(3Y) ; port PWM_MPPT
PWM_Sine_A: J2.25 U19.8(3Y) ; port PWM_Sine_A
PWM_Sine_B: J2.28 U19.11(4Y) ; port PWM_Sine_B
PWM_Sine_V27: V2.1(G) V7.1(G) ; port PWM_Sine_V27
PWM_Sine_V36: V3.1(G) V6.1(G) ; port PWM_Sine_V36
R80-1: D14.3(A) R80#2.8 ; port R80-1
Relay_1: J2.16 ; port Relay_1
Relay_2: J2.15 ; port Relay_2
Relay_3: J2.2 ; port Relay_3
Relay_4: J2.13 ; port Relay_4
Relay_5: J2.14 R?#15.2 ; port Relay_5
Ss_IPV: J1.26 ; port Ss_IPV
Ss_Trans_1: J1.13 J1.15 R62.2 ; port Ss_Trans_1
Ss_Trans_2: J1.14 J1.16 R74.2 ; port Ss_Trans_2
Ss_Vout_EVN: J1.1 ; port Ss_Vout_EVN
Ss_Vref_ENV: J1.2 ; port Ss_Vref_ENV
TCK: JP1.9 JP1.11 MCU1.81(TCK) R130.1 ; port TCK
TDI: JP1.3 MCU1.77(TDI) R132.1 ; port TDI
TDO: JP1.7 MCU1.78(TDO) R129.1 ; port TDO
TMS: JP1.1 MCU1.80(TMS) R128.1 ; port TMS
TRST: JP1.2 MCU1.79(TRST) R270.2 ; port TRST
U6-1IN+: C24.1 D4.3(A) R105.1 R116.2 U6#1.7(1IN+) ; port U6-1IN+
U6-2IN-: D43.2(C) R46.2 R92.2 R119.1 R253.2 R289.2 U6#1.4(2IN-) ; port U6-2IN-
U6-3IN+: C168.1 R22.1 R159.2 R?#13.2 U6#1.9(3IN+) ; port U6-3IN+
U6-3IN-: C?#13.2 R?#13.1 U6#1.8(3IN-) ; port U6-3IN-
U6-OUT3: R22.2 R92.1 R161.2 U6#1.14(OUT3) ; port U6-OUT3
U15-3A: U13.1(1A) U15.3(1Y) U15.9(3A) ; port U15-3A
U16-2B: U13.13(6A) U16.5(2B) U16.8(3Y) ; port U16-2B
U23-4A: U23.8(3Y) U23.12(4A) ; port U23-4A
U23-4B: C31.2 R147.1 R173.1 U23.13(4B) ; port U23-4B
VDD: FB7.2 MCU1.16(VDD) MCU1.21(VDD) MCU1.61(VDD) MCU1.76(VDD) MCU1.117(VDD) MCU1.126(VDD) MCU1.137(VDD) MCU1.153(VDD) MCU1.158(VDD) MCU1.169(VDD) ; port VDD
Vout_SsAC: J1.36 R158.2 ; port Vout_SsAC
Vout_SsBoost: J1.11 J1.12 R114.1 ; port Vout_SsBoost
Vref_SsAC: J1.33 R100.2 ; port Vref_SsAC
Vref_SsBoost: J1.9 J1.10 R113.1 ; port Vref_SsBoost
NetC7_2: C7.2 D37.3(A) R9.2 R80#2.5
NetC8_2: C8.2 D36.3(A) R197.8
NetC14_2: C14.2 R30.1 R62.1 U4.3(1_IN+)
NetC15_2: C15.2 R13.1 R15.1 U29.5(2_IN+)
NetC16_2: C16.2 R154.1 R155.2 U4.12(4_IN+)
NetC17_1: C17.1 R70.2 R71.2 U5.5(2_IN+)
NetC21_1: C21.1 R161.1 R162.2
NetC30_2: C30.2 R145.1 R287.1 U23.10(3B)
NetC32_1: C32.1 R123.1 R167.1 U23.9(3A)
NetC38_1: C38.1 R101.2 R155.1 U4.1(1_OUT)
NetC38_2: C38.2 R74.1 R101.1 U4.2(1_IN-)
NetC40_1: C40.1 R14.2 R29.2 U5.3(1_IN+)
NetC42_1: C42.1 C82.2 C83.1 R75.2 R76.2 R284.2 U5.6(2_IN-) U6#2.6(IN-) U6#2.10(IN-) U11#1.6(IN-) U24.1(1_OUT) U24.2(1_IN-) U26#1.6(IN-)
NetC42_2: C42.2 R76.1 R176.1 U5.7(2_OUT)
NetC52_1: C52.1 D66.3(A) R176.2 R198.8
NetC53_2: C53.2 D46.3(A) R200#1.4 R266.1
NetC58_1: C58.1 R251.2 R?#10.1 U29.7(2_OUT)
NetC58_2: C58.2 R196.1 R251.1 U29.6(2_IN-)
NetC67_1: C67.1 R240#1.2 R240#2.2 U5.2(1_IN-)
NetC67_2: C67.2 R240#1.1 R?#3.1 U5.1(1_OUT)
NetC72_2: C72.2 D35.3(A) R197.7
NetC83_2: C83.2 R158.1 R284.1 U24.10(3_IN+)
NetC87_2: C87.2 R95.2 U12#1.8(OUT)
NetC96_1: C96.1 R187.2 R191.1 U26#2.3(1_IN+)
NetC99_1: C99.1 R192.1 U26#2.5(2_IN+)
NetC123_2: C123.2 R95.1 R154.2 U6#2.4(-)
NetC147_1: C147.1 C280.2 R78.2 R211.1 U12#2.10(3_IN+)
NetC147_2: C147.2 R5.1 R78.1 U29.10(3_IN+)
NetC149_1: C149.1 R9.1 R80#1.2 U29.8(3_OUT)
NetC149_2: C149.2 R6.1 R80#1.1 U29.9(3_IN-)
NetC153_2: C153.2 R86.2 U10.9(IN-)
NetC159_2: C159.2 D16.2(C) R37.1 U15.2(1B)
NetC161_2: C161.2 D19.2(C) R60.2 U15.10(3B)
NetC162_2: C162.2 D20.1(C) R41.2 U15.4(2A)
NetC165_1: C165.1 R114.2 R149.1 U29.12(4_IN+)
NetC166_1: C166.1 D72.3(A) R150.2 R156.2 R294.1 U29.14(4_OUT)
NetC166_2: C166.2 R113.2 R150.1 U29.13(4_IN-)
NetC170_1: C170.1 D51.3(A) R24.2 R?#1.6
NetC198_2: C198.2 R248.1 U5.10(3_IN+)
NetC280_1: C280.1 R156.1 R211.2 U8.10(3_IN+)
NetC281_1: C281.1 R24.1 R56.1 U24.8(3_OUT)
NetC281_2: C281.2 R56.2 R100.1 U24.9(3_IN-)
NetC885_2: C885.2 R20.2 R21.1 U24.3(1_IN+)
NetC?#2_2: C?#2.2 R?#2.1 X?.2
NetC?#4_2: C?#4.2 MCU1.121(X2) X?.1
NetC?#5_1: C?#5.1 D?#1.3(A) R198.7 R?#3.2
NetC?#10_1: C?#10.1 D?#3.3(A) R200#2.6 R?#10.2
NetC?#20_2: C?#20.2 C?#21.2 FB7.1 R?#16.2 U?#3.2(VOUT) U?#3.4(VOUT)
NetC?#24_1: C?#24.1 R90.4 U1#2.8(3_OUT) U1#2.9(3_IN-)
NetD3_1: D3.1(C) R66.2
NetD3_2: D3.2(C) R168.2
NetD3_3: D3.3(A) U11#2.7(1IN+)
NetD4_2: D4.2(C) R64.2
NetD8_1: D8.1 R119.2
NetD8_2: D8.2 R46.1 R64.1 R145.2 U6#1.1(1OUT)
NetD9_1: D9.1 R120.2
NetD9_2: D9.2 R147.2
NetD10_1: D10.1 R121.2
NetD10_2: D10.2 R66.1 U11#2.1(1OUT)
NetD16_3: D16.3(A) R37.2 U13.4(2Y)
NetD19_3: D19.3(A) R60.1 U13.10(5Y)
NetD20_3: D20.3(A) R41.1 U13.2(1Y)
NetD43_3: D43.3(A) R162.1 R166.2
NetD46_2: D46.2(C) R121.1
NetD72_1: D72.1(C) D72.2(C) D73.1(C) D73.2(C) R248.2
NetD73_3: D73.3(A) R295.1 U8.14(4_OUT)
NetH?#1_1: H?#1.1 V2.3(E) V6.2(C) V8.3(E)
NetH?#2_1: H?#2.1 V3.3(E) V5.3(E) V7.2(C)
NetJP1_13: JP1.13 R133.1
NetJP1_14: JP1.14 R131.1
NetMCU1_107: MCU1.107(GPIO61) R169.2
NetMCU1_123: MCU1.123(X1) R?#2.2
NetR86_1: R86.1 U4.13(4_IN-) U4.14(4_OUT)
NetR105_2: R105.2 R253.1 U6#1.2(2OUT)
NetR120_1: R120.1 R293.2
NetR126_1: R126.1 U15.11(4Y)
NetR192_2: R192.2 R215.1 U26#2.1(1_OUT)
NetR201_5: R201.5 R209.2 U20.10(3B)
NetR201_6: R201.6 R209.1 U20.4(2A)
NetR201_7: R201.7 R209.3 U20.13(4B)
NetR201_8: R201.8 R209.4 U20.1(1A)
NetR202_1: R202.1 R210.7 U13.3(2A) U16.10(3B)
NetR202_2: R202.2 R210.5 U13.9(4A) U16.1(1A)
NetR202_3: R202.3 R210.6 U13.11(5A) U15.5(2B)
NetR202_4: R202.4 R210.8 U13.5(3A) U15.1(1A)
NetR205_5: R205.5 R207.2 U14.3(2A) U17.9(3A)
NetR205_6: R205.6 R207.1 U14.9(4A) U17.13(4B)
NetR205_7: R205.7 R207.3 U14.1(1A) U17.1(1A)
NetR205_8: R205.8 R207.4 U14.5(3A) U17.5(2B)
NetR214_1: R214.1 R215.2 U26#2.2(1_IN-)
NetR266_2: R266.2 U1#1.1(1OUT) U1#1.7(2OUT)
NetR285_1: R285.1 R293.1 U9.13(OUT4)
NetR285_2: R285.2 U6#1.11(4IN+)
NetR294_2: R294.2 R295.2 U8.13(4_IN-)
NetR?#14_1: R?#14.1 U23.4(2A)
NetR?#15_1: R?#15.1 U23.6(2Y)
NetU13_6: U13.6(3Y) U16.9(3A)
NetU13_8: U13.8(4Y) U16.4(2A)
NetU13_12: U13.12(6Y) U16.2(1B)
NetU15_6: U15.6(2Y) U19.1(1A)
NetU15_8: U15.8(3Y) U19.13(4B)
NetU16_3: U16.3(1Y) U19.4(2A)
NetU16_6: U16.6(2Y) U19.10(3B)
NetU17_3: U17.3(1Y) U21.1(1A)
NetU17_6: U17.6(2Y) U21.4(2A)
NetU17_8: U17.8(3Y) U21.13(4B)
NetU17_11: U17.11(4Y) U21.10(3B)
NetU18_1: U18.1(1A) U18.4(2A) U18.9(3A) U18.12(4A) U23.11(4Y)
NetU18_3: U18.3(1Y) U19.2(1B) U19.5(2B) U19.9(3A) U19.12(4A)
NetU18_8: U18.8(3Y) U21.2(1B)
NetU20_2: U20.2(1B) U20.12(4A)
NetU20_5: U20.5(2B) U20.9(3A)
NetU23_2: U23.2(1B) U23.5(2B)
NetU26#2_6: U26#2.6(2_IN-) U26#2.7(2_OUT) U?#2.9(3_IN-)
NetV5_2: V5.2(C) V8.2(C)

Not connected (* = marked no-connect by the designer): D4 1(C); D16 1(C)*; D19 1(C)*; D20 2(C)*; J1 5*; J2 1* 3* 17* 18*; JP1 6*; MCU1 11(VDDIO) 18(GPIO8) 19(GPIO9) 22(GPIO22) 23(GPIO23) 24(GPIO24) 25(GPIO25) 27(GPIO26) 28(GPIO27) 30(ADCINC3) 31(ADCINC2) 41(ADCINA2) 43(ADCINA0) 45(ADCIN15) 47(ADCINB1) 56(ADCIND0) 58(ADCIND2) 59(ADCIND3) 63(GPIO30) 64(GPIO28) 65(GPIO29) 66(GPIO31) 67(GPIO32) 68(VDDIO) 69(GPIO33) 70(GPIO34) 71(GPIO35) 72(VDD3VLF) 73(FLT1) 74(FLT2) 75(VDDIO) 82(VDDIO) 83(GPIO36) 84(GPIO37) 85(GPIO38) 86(GPIO39) 87(GPIO40) 88(VDDIO) 90(GPIO48) 91(VDDIO) 92(ERRORSTS) 93(GPIO49) 94(GPIO50) 95(GPIO51) 96(GPIO52) 97(GPIO53) 98(GPIO54) 99(VDDIO) 100(GPIO55) 101(GPIO56) 102(GPIO57) 103(GPIO58) 104(GPIO59) 105(GPIO60) 106(VDDIO) 108(GPIO62) 109(GPIO63) 111(GPIO65) 112(GPIO66) 114(VDDIO) 115(GPIO45) 116(VDDIO) 118(GPIO133) 122(VSSOSO) 124(XRS) 127(VDDIO) 128(GPIO46) 129(GPIO47) 130(GPIO42) 132(GPIO67) 133(GPIO68) 135(GPIO70) 136(GPIO71) 138(VDDIO) 139(GPIO72) 140(GPIO73) 141(GPIO74) 142(GPIO75) 143(GPIO76) 144(GPIO77) 145(GPIO78) 146(GPIO79) 147(VDDIO) 148(GPIO80) 149(GPIO81) 150(GPIO82) 151(GPIO83) 152(VDDIO) 154(GPIO84) 155(GPIO85) 157(GPIO87) 159(VDDIO) 160(GPIO0) 161(GPIO1) 164(GPIO4) 165(GPIO5) 166(GPIO6) 167(GPIO7) 168(VDDIO) 171(GPIO89) 172(GPIO90) 173(GPIO91) 174(GPIO92) 175(GPIO93) 176(GPIO94); R80#2 1 2 3 6 7; R90 1 2 3 6 7 8; R126 2; R197 3 4 5 6; R198 3 4 5 6; R200#1 1 2 3 6 7 8; R200#2 1 2 4 5 7 8; R289 1; R?#1 1 2 4 5 7 8; R?#14 2 3 4 5 6 7; U 1(1OUT) 2(1IN-) 3(1IN+) 4(VCC+) 5(2IN+) 6(2IN-) 7(2OUT) 8(3OUT) 9(3IN-) 10(3IN+) 11(VCC-) 12(4IN+) 13(4IN-) 14(4OUT); U1#1 2(1IN-) 3(1IN+) 4(VCC+) 5(2IN+) 6(2IN-) 8(3OUT) 9(3IN-) 10(3IN+) 11(VCC-) 12(4IN+) 13(4IN-) 14(4OUT); U1#2 10(3_IN+); U5 8(3_OUT) 9(3_IN-); U6#1 3(VCC) 5(2IN+) 6(1IN-) 10(4IN-) 12(GND) 13(OUT4); U6#2 1(OUT) 2(OUT) 3(VCC) 5(+) 7(IN+) 11(IN+) 12(GND) 13(15); U8 8(3_OUT) 9(3_IN-) 12(4_IN+); U9 1(1OUT) 2(2OUT) 3(VCC) 4(2IN-) 5(2IN+) 6(1IN-) 7(1IN+) 8(3IN-) 9(3IN+) 10(4IN-) 11(4IN+) 12(GND) 14(OUT3); U10 8(OUT) 14(15); U11#1 1(OUT) 7(IN+); U11#2 2(2OUT) 3(VCC) 4(2IN-) 5(2IN+) 6(1IN-) 8(3IN-) 9(3IN+) 10(4IN-) 11(4IN+) 12(GND) 13(OUT4) 14(OUT3); U12#1 9(IN-) 14(15); U12#2 8(3_OUT) 9(3_IN-); U13 7(GND) 14(VCC); U14 2(1Y) 4(2Y) 6(3Y) 7(GND) 8(4Y) 10(5Y) 11(5A) 12(6Y) 13(6A) 14(VCC); U15 12(4A) 13(4B); U16 7(GND) 11(4Y) 12(4A) 13(4B) 14(VCC); U17 2(1B) 4(2A) 7(GND) 10(3B) 12(4A) 14(VCC); U18 5(2B) 6(2Y) 7(GND) 10(3B) 11(4Y) 13(4B) 14(VCC); U20 7(GND) 14(VCC); U21 5(2B) 9(3A) 12(4A); U23 1(1A) 3(1Y) 7(GND) 14(VCC); U24 4(VCC) 11(VEE); U26#1 1(OUT) 7(IN+); U?#1 1(1OUT) 2(2OUT) 3(VCC) 4(2IN-) 5(2IN+) 6(1IN-) 7(1IN+) 8(3IN-) 9(3IN+) 10(4IN-) 11(4IN+) 12(GND) 13(OUT4) 14(OUT3); U?#2 8(3_OUT) 10(3_IN+)

## Layout directives
mark named Phần bảo vệ: NetC8_2, NetC72_2
mark named 1.7V RMS: NetC147_1
mark named 1.14V RMS: NetC280_1
mark named 0V: NetC166_1
mark named 1-U24A: NetC147_1

## Notes on the sheet
- Tạo điện áp tham chiếu 1.65V cho opamp
- (near R9) offset 1.7V

## Library data of the parts
C7 C8 C14-C17 C21 C24 C30-C32 C34 C35 C38 C40 C42 C52 C53 C58 C67 C72 C82 C83 C87 C89 C96-C100 C120 C123 C129 C132 C147 C149 C153 C159-C162 C165 C166 C168 C170 C185 C189 C198 C202 C207 C225 C236 C280 C281 C885 C?#1-C?#24 = CAP-SMD: Value: 33pF
CE210 = CAP-ALU-SMD: Published: 8-Jun-2000; LatestRevisionDate: 17-Jul-2002; LatestRevisionNote: Re-released for DXP Platform.; PackageReference: POLAR0.8; Publisher: Altium Limited
D3 D4 D14 D16 D19 D20 D35-D37 D43 D46 D51 D66 D?#1-D?#3 = Dual-Diode_CA_1: BAT54S(D88) thay the BAV99:A7; ki_keywords: Dual Diode Common Anode; Value: Dual_Diode_CA; Reference: D; ki_description: Dual Diode Common Anode
D8-D10 = LED1-SMD: Value: LED 3 - 5 ly 2 Colour
D72 D73 = Dual-Diode_CA: LBAS40-06LT1G / S-LBAS40-06LT1G; ki_keywords: Dual Diode Common Anode; Value: Dual_Diode_CA; Reference: D; ki_description: Dual Diode Common Anode
FB1-FB3 FB7 FB? = RC0603FR-0775RL: RES SMD 75 OHM 1% 1/10W 0603; Solder: SMT; Value: 75R; MPN: RC0603FR-0775RL; Category: RESISTOR; PinCount: 2
H?#1 H?#2 = Copper
J1 = Header 25x2: Header, 25x2-Pin 2.5mm; LatestRevisionDate: 17-Jul-2002; LatestRevisionNote: Re-released for DXP Platform.; Publisher: Altium Limited
J2 = Header 15x2: Header, 15x2-Pin 2.5mm; LatestRevisionDate: 17-Jul-2002; LatestRevisionNote: Re-released for DXP Platform.; Publisher: Altium Limited
JP1 = Header 7x2: Header, 15x2-Pin 2.5mm; LatestRevisionDate: 17-Jul-2002; LatestRevisionNote: Re-released for DXP Platform.; Publisher: Altium Limited
R5 R6 R9 R13-R15 R20-R22 R24 R29 R30 R37 R41 R46 R56 R60 R62 R64 R66 R70 R71 R74-R76 R78 R80#1 R86 R92 R95 R100 R101 R105 R113 R114 R119-R121 R123 R128-R133 R145 R147 R149 R150 R154-R156 R158 R159 R161 R162 R166-R169 R173 R176 R187 R191 R192 R196 R211 R214 R215 R240#1 R240#2 R248 R251 R253 R266 R270 R284 R285 R287 R289 R293-R295 R?#2-R?#13 R?#16 = Res-SMD: Resistor; Manufacturer: Generic Components; Class: Passive; Published: 08/06/2000; Publisher: Altium Hobart Technology Centre
R80#2 R90 R197 R198 R200#1 R200#2 R201 R202 R205 R207 R209 R210 R?#1 R?#14 = Network Resistor: MF: {'manufacturer': u'Vishay Beyschlag'}; MP: ACASA1002S1002P1AT; Package: None; Price: None; Value: *; Availability: Unavailable
R116 R?#15 = Res-SMD: 0603; Manufacturer: Generic Components; Class: Passive; Published: 08/06/2000; Publisher: Altium Hobart Technology Centre
R126 = Res: Manufacturer: Generic Components; Class: Passive; SubClass: R; Published: 08/06/2000; Publisher: Altium Hobart Technology Centre
U U1#1 = TL084CD: Quad High Slew Rate JFET-Input Operational Amplifier 14-SOIC 0 to 70; MF: Texas Instruments; DigiKey-Purchase-URL: https://snapeda.com/shop?store=DigiKey&id=139348; Package: SOIC-14 Texas Instruments; Mouser-Purchase-URL: https://snapeda.com/shop?store=Mouser&id=139348; MP: TL084CD; Value: *; SnapEDA_Link: https://www.snapeda.com/parts/TL084CD/Texas%20Instruments/view-part/139348/?ref=snap; Digi-Key_Part_Number: 296-1285-2-ND; BuyPart: https://www.snapeda.com/parts/TL084CD/Texas%20Instruments/view-part/139348/?ref=eda
U1#2 U4 U5 U8 U12#2 U24 U26#2 U29 U?#2 = LF347: Low Power Quad Operational Amplifier; Manufacturer Part Number: LF347BD; Manufacturer: Texas Instruments; Text Field1: pristel=Nsc\nsanopea\<parttype>.ckt; Slew Rate: 13 V/µs; Voltage - Supply, Single/Dual (±): 7 V ~ 36 V, ±3.5 V ~ 18 V; Current - Input Bias: 50pA; Voltage - Input Offset: 3000µV; Number of Circuits: 4; Gain Bandwidth Product: 3MHz; Amplifier Type: J-FET; Current - Supply: 8mA; Supplier 1: Digi-Key; Supplier Part Number 1: 296-7136-5-ND; Package / Case: 14-SOIC (3.9mm Width), 14-SOL; Supplier: Digi-Key; Current - Output / Channel: -; Packaging: Tube; RoHS: RoHS Compliant; Output Type: -; Operating Temperature: 0°C ~ 70°C; Category: Integrated Circuits (ICs); Supplier Part Number: 296-7136-5-ND
U6#2 U10 U11#1 U12#1 U26#1 = LM339: Low Power Low Offset Voltage Quad Comparators
U13 U14 = SN74ACT14DRG4: Hex Schmitt-Trigger Inverters 14-SOIC -40 to 85; MF: Texas Instruments; SnapEDA_Link: https://www.snapeda.com/parts/SN74ACT14DRG4/Texas+Instruments/view-part/?ref=snap; Package: SOIC-14 Texas Instruments; Value: *; MP: SN74ACT14DRG4; Check_prices: https://www.snapeda.com/parts/SN74ACT14DRG4/Texas+Instruments/view-part/?ref=eda
U15-U21 U23 = SN74ACT08DR: Quadruple 2-Input Positive-AND Gates 14-SOIC -40 to 85; MF: Texas Instruments; Mouser-Purchase-URL: https://snapeda.com/shop?store=Mouser&id=433506; Package: SOIC-14 Texas Instruments; Texas_Instruments-Purchase-URL: https://snapeda.com/shop?store=Texas+Instruments&id=433506; Digi-Key_Part_Number: 296-1066-1-ND; Value: *; SnapEDA_Link: https://www.snapeda.com/parts/SN74ACT08DR/Texas%20Instruments/view-part/433506/?ref=snap; DigiKey-Purchase-URL: https://snapeda.com/shop?store=DigiKey&id=433506; MP: SN74ACT08DR; Arrow_Electronics-Purchase-URL: https://snapeda.com/shop?store=Arrow+Electronics&id=433506; Check_prices: https://www.snapeda.com/parts/SN74ACT08DR/Texas%20Instruments/view-part/433506/?ref=eda
U25 U?#3 = AMS1117 SMD: Dán; Value: AMS1117-3.3V SOT223; Don_Vi: Con; Ma_Hang: MH000596; Ghi_Chu: *; Kieu_Chan: *; Chung_Loai: Dán
V2 V3 V5-V8 = FGA25N120ANTD: IGBT NPT STGWA80H65DFB; MF: ON Semiconductor; Value: *; Digi-Key_Purchase_URL: https://www.digikey.in/product-detail/en/on-semiconductor/FGA25N120ANTDTU/FGA25N120ANTDTU-ND/820640?utm_source=snapeda&utm_medium=aggregator&utm_campaign=symbol; MP: FGA25N120ANTD; Package: TO-3 Fairchild Semiconductor; SnapEDA_Link: https://www.snapeda.com/parts/FGA25N120ANTD/ON%20Semiconductor/view-part/202622/?ref=snap; Digi-Key_Part_Number: FGA25N120ANTDTU-ND
X? = XT2: Crystal, 32.768 KHz, -40 to 85 degC, 3.2 x 1.5 x 0.9 mm SMD; Value: 4Mhz
U6#1 U9 U11#2 U?#1 = LM339D: Price: None; Value: *; Package: None; Availability: Unavailable; MP: LM339D